# EAGLE board headstage-256_via-reduce (EAGLE 8.3.2), part 1 of 4
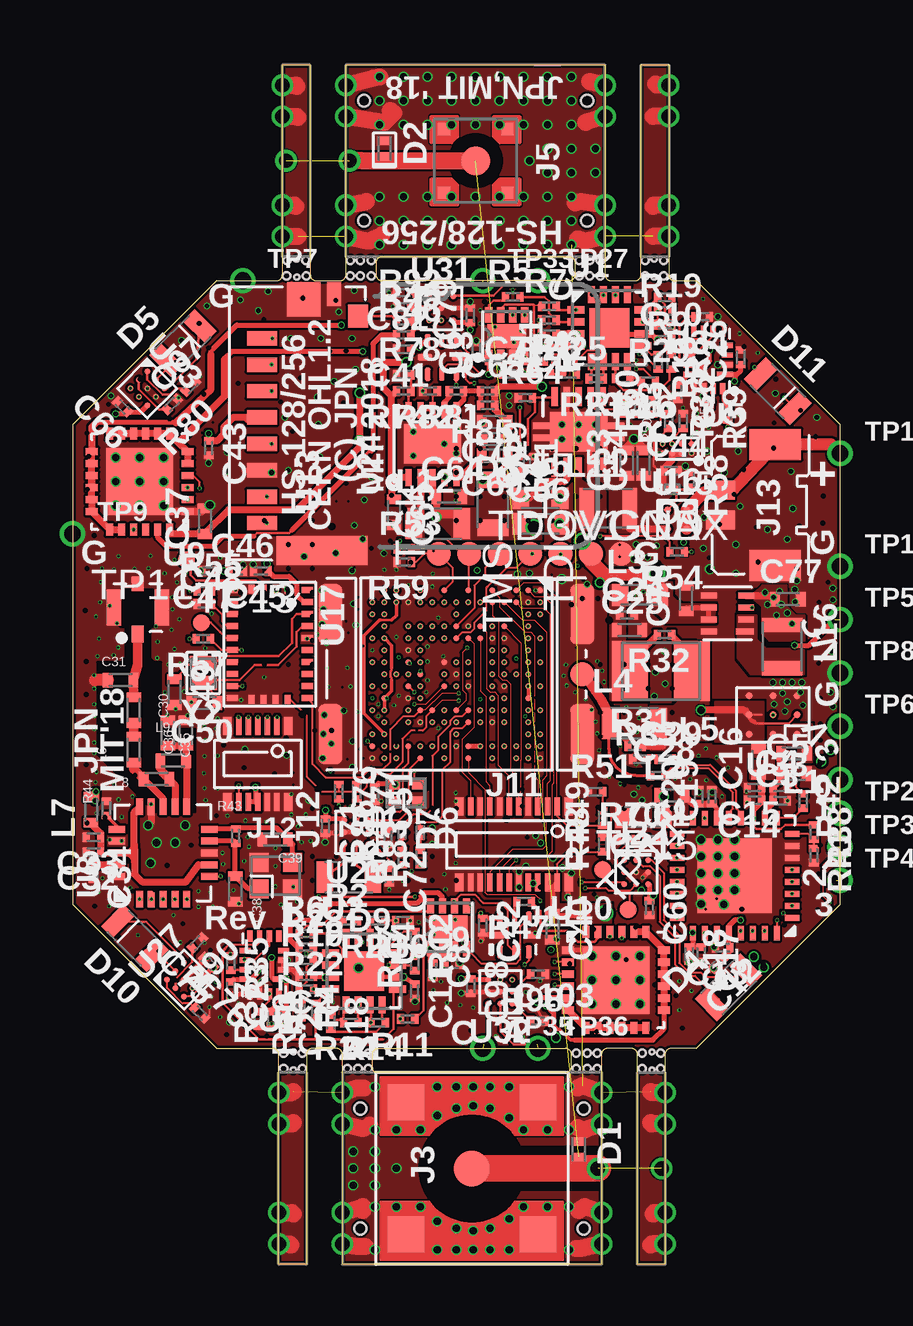
[diagram p10: board, top side]
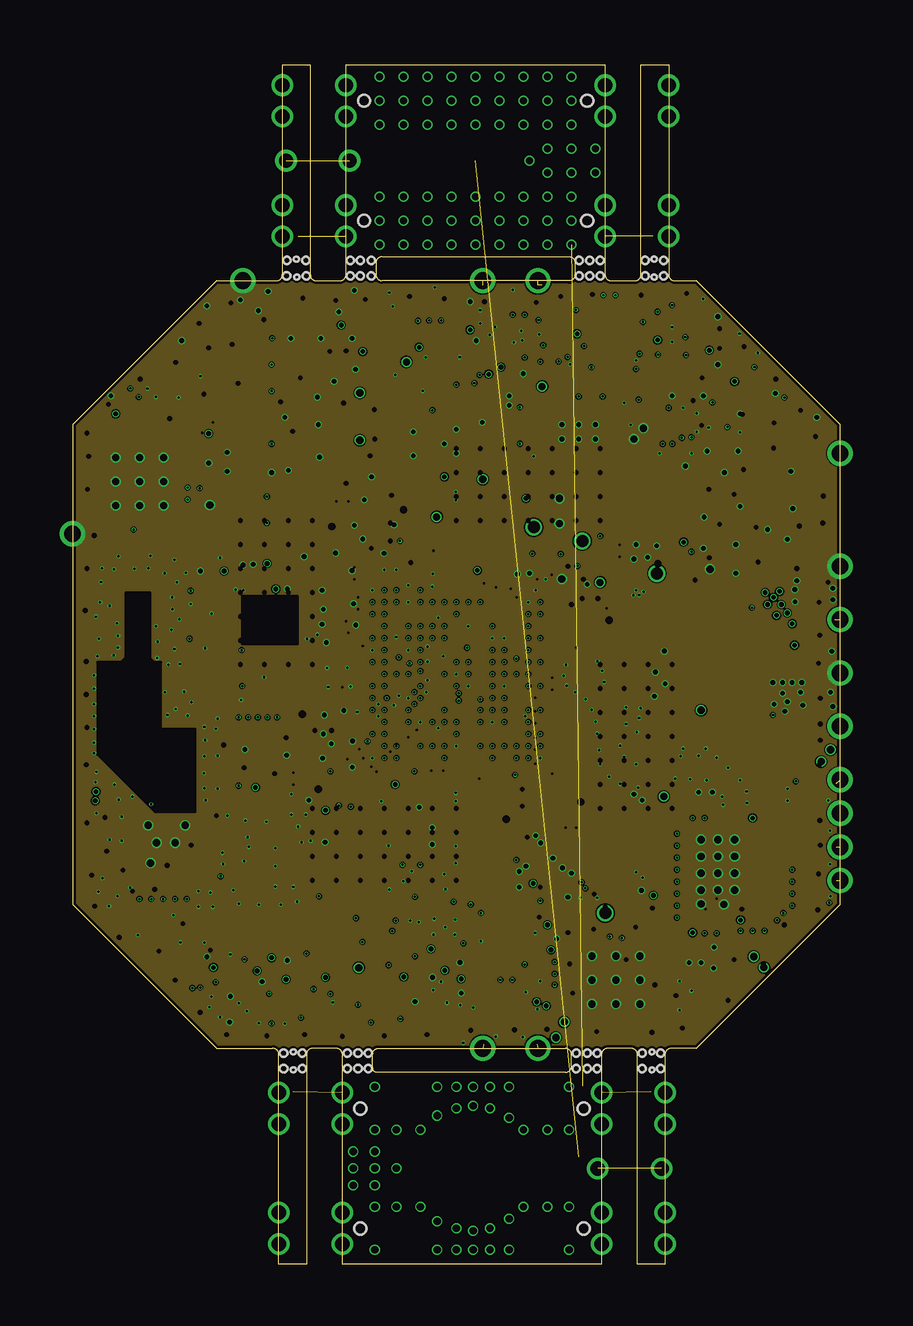
[diagram p11: board, inner layer GND1]
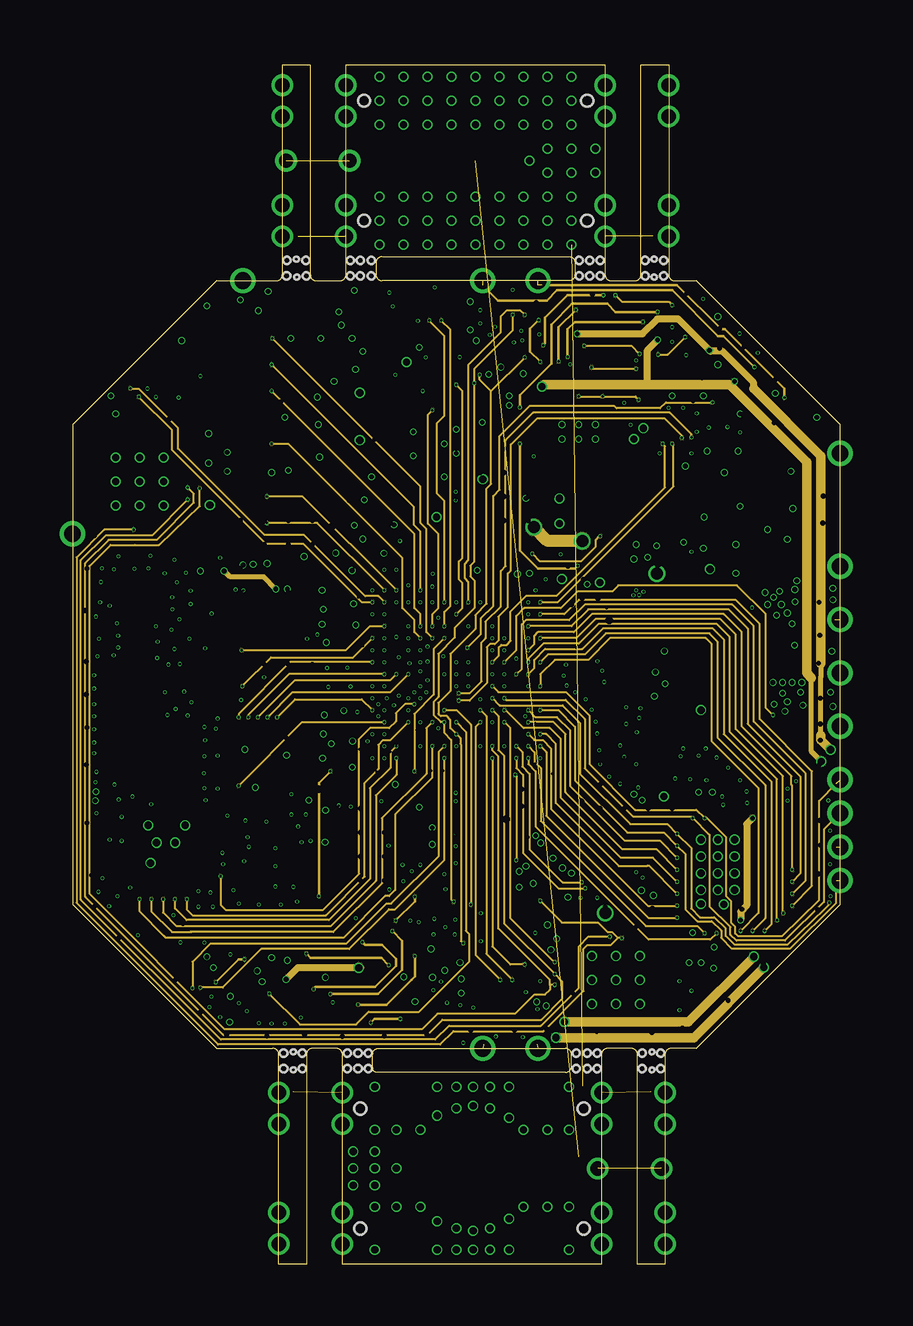
[diagram p12: board, inner layer Signal]
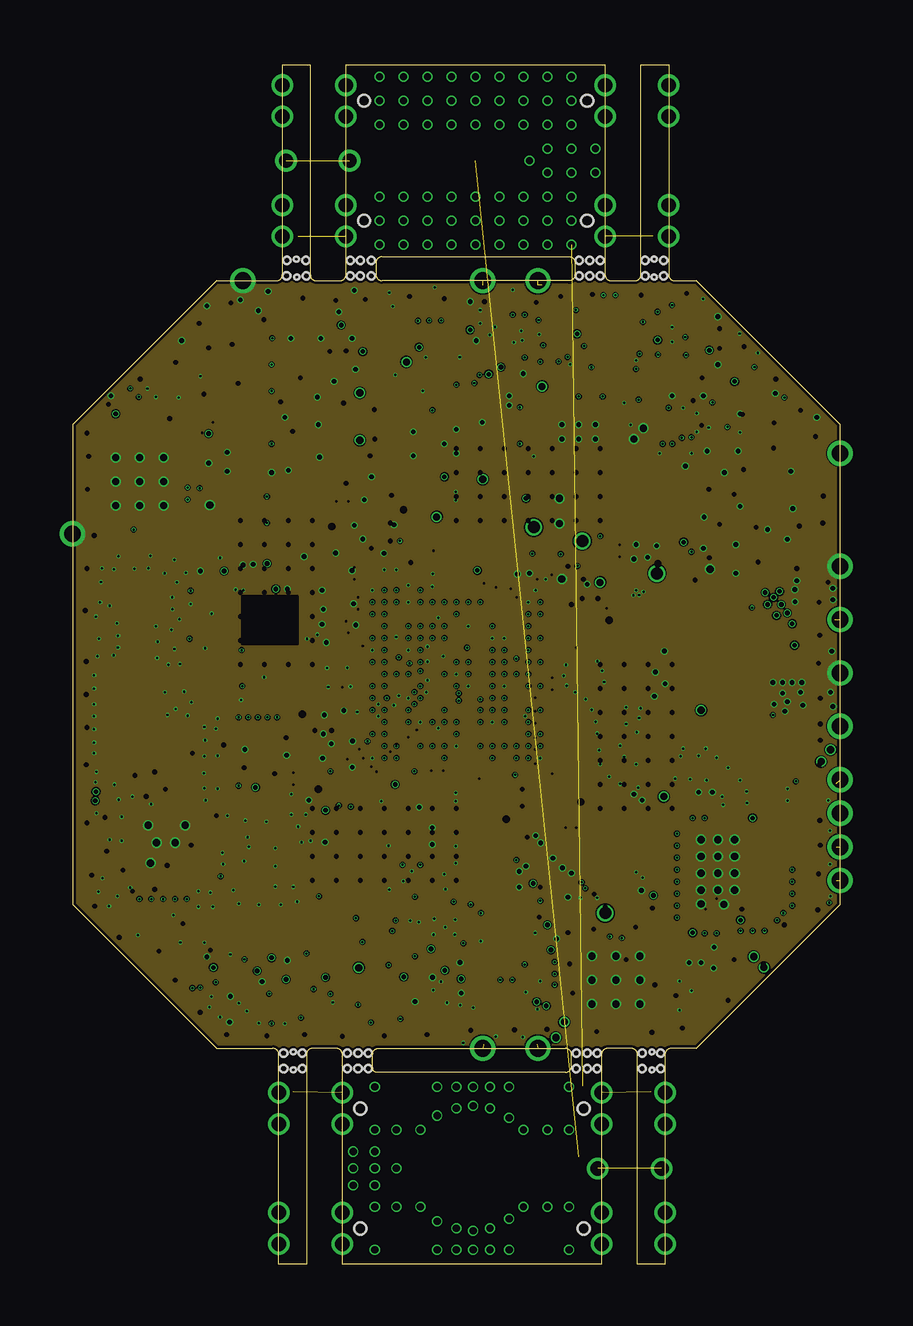
[diagram p13: board, inner layer GND2]
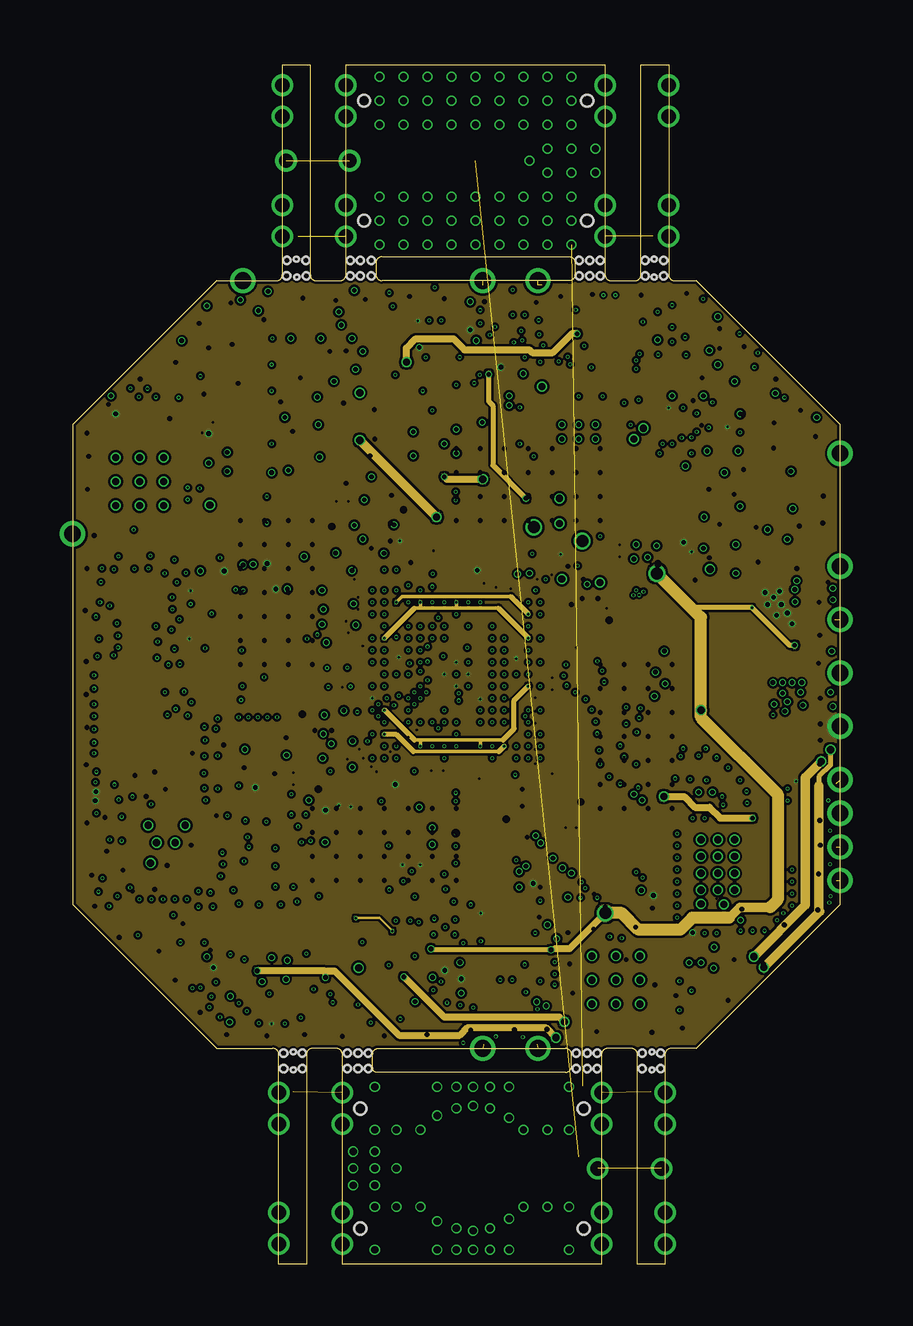
[diagram p14: board, inner layer Supply]
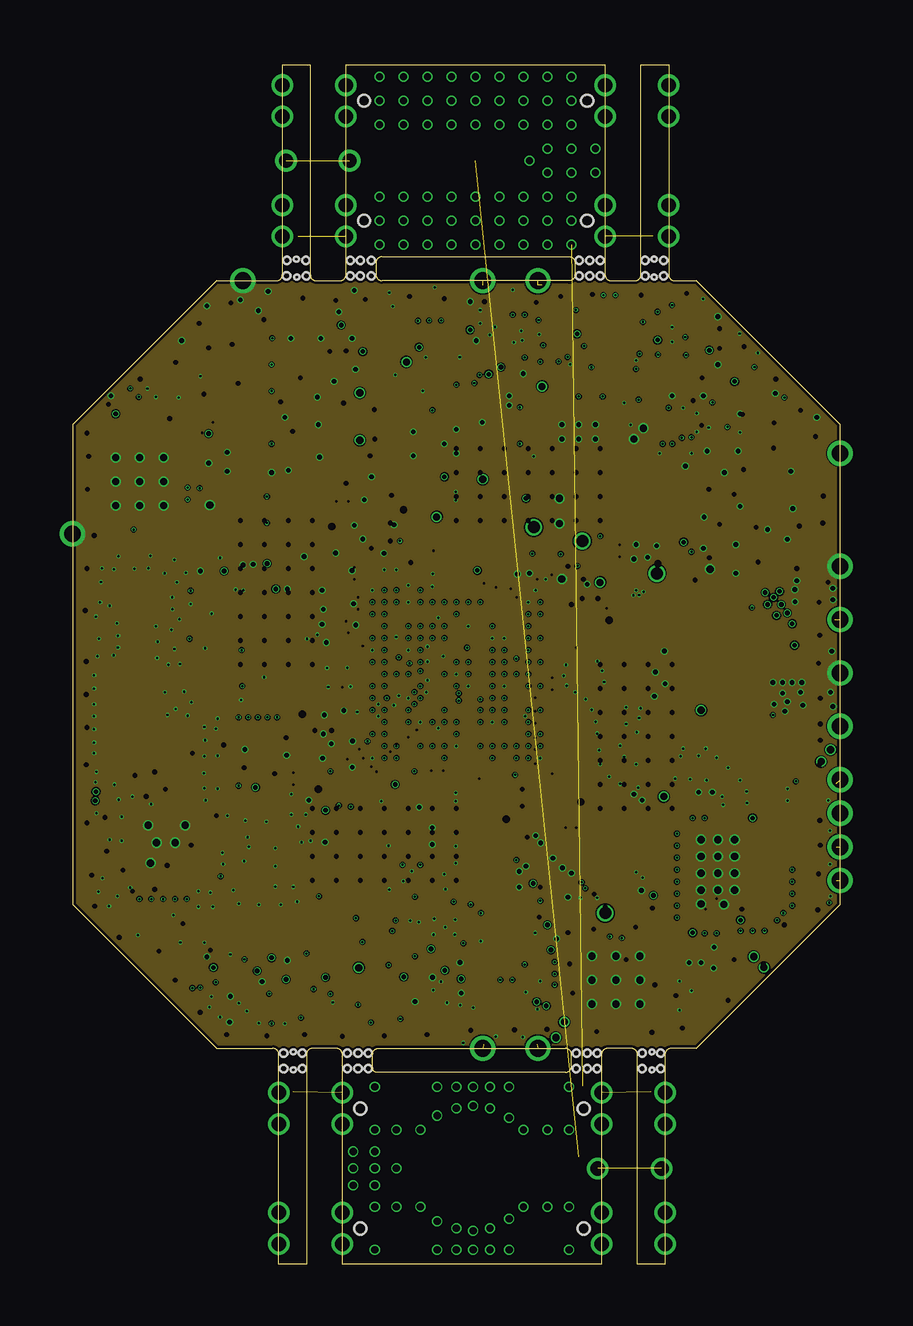
[diagram p15: board, inner layer GND3]
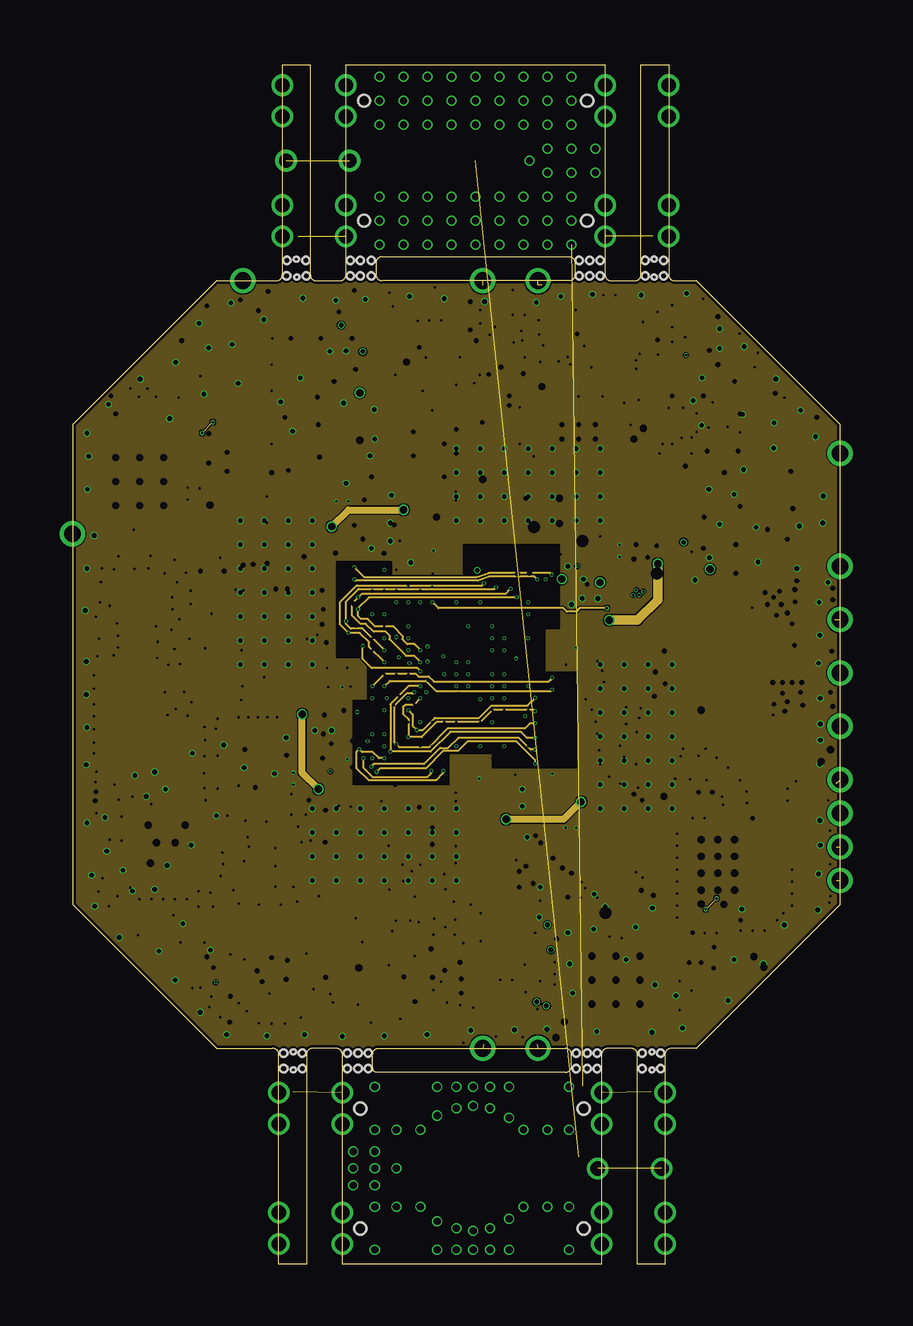
[diagram p16: board, inner layer AGND]
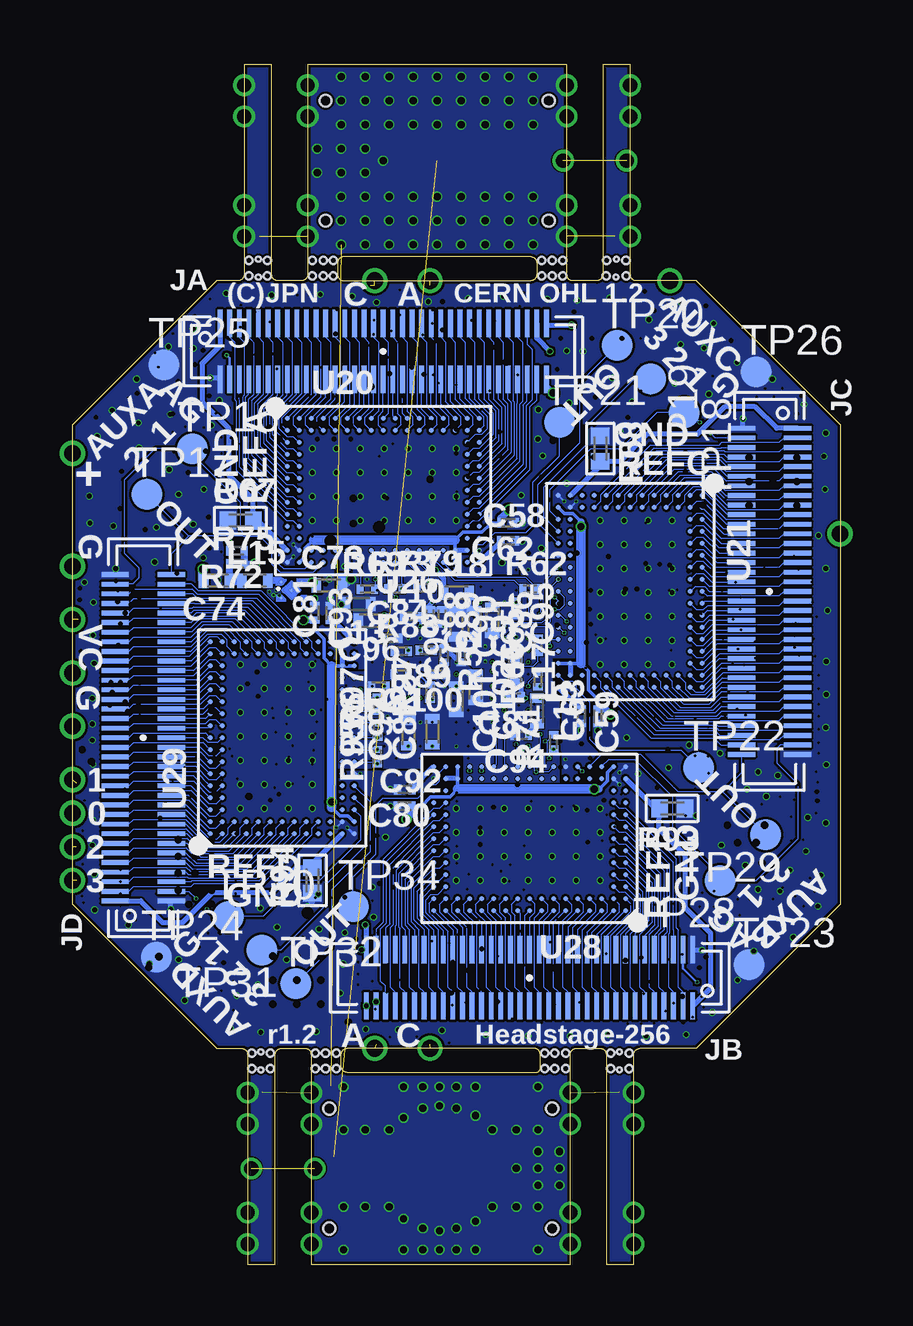
[diagram p17: board, bottom side, seen from below]

Size 32 x 50 mm. Coordinates in mm from the lower left corner, seen from the top.
Outline: 32,15 32,35 26,41 25.1,41 arc-90 24.85,41.25 24.85,50 23.7,50 23.7,41.25 arc-90 23.45,41 22.45,41 arc-90 22.2,41.25 22.2,50 11.4,50 11.4,41.25 arc-90 11.15,41 10.15,41 arc-90 9.9,41.25 9.9,50 8.75,50 8.75,41.25 arc-90 8.5,41 6,41 0,35 0,15 6,9 8.35,9 arc-90 8.6,8.75 8.6,0 9.75,0 9.75,8.75 arc-90 10,9 11,9 arc-90 11.25,8.75 11.25,0 22.05,0 22.05,8.75 arc-90 22.3,9 23.3,9 arc-90 23.55,8.75 23.55,0 24.7,0 24.7,8.75 arc-90 24.95,9 26,9 32,15
Outline: 12.9,42 arc90 12.65,41.75 12.65,41.25 arc90 12.9,41 20.7,41 arc90 20.95,41.25 20.95,41.75 arc90 20.7,42 12.9,42
Outline: 20.55,8 arc90 20.8,8.25 20.8,8.75 arc90 20.55,9 12.75,9 arc90 12.5,8.75 12.5,8.25 arc90 12.65,8 20.55,8
Copper layers ((1*2*3*4+5*6)*(7*16)): Top 0.019mm / dielectric 0.0622mm / GND1 0.019mm / dielectric 0.0622mm / Signal 0.019mm / dielectric 0.0622mm / GND2 0.019mm / dielectric 0.326mm / Supply 0.019mm / dielectric 0.0622mm / GND3 0.019mm / dielectric 0.0622mm / AGND 0.019mm / dielectric 0.0622mm / Bottom 0.019mm
Design rules "headstage-256 *": minimum track width 2mil, minimum drill 3mil, track to track 2mil, track to pad 2mil, pad to pad 2mil, via to via 2mil, smd to smd 2mil, copper to edge 5mil, drill to drill 5mil, minimum pad ring 2mil, minimum via ring 1mil, stop-mask expansion 1mil, vias tented up to drill 1mm, thermal gap 10mil
Net classes: 1 thick: width 0.102 mm
Holes 0.3 mm at 9.75,41.2 8.93,41.2 24.65,41.85 23.88,41.85 24.65,41.2 23.88,41.2 12.45,41.85 12,41.85 11.57,41.85 12.45,41.2 12,41.2 11.57,41.2 22,41.85 21.55,41.85 21.12,41.85 22,41.2 21.55,41.2 21.12,41.2 23.75,8.15 24.52,8.15 23.75,8.8 24.52,8.8 8.8,8.15 9.57,8.15 8.8,8.8 9.57,8.8 21,8.15 21.45,8.15 21.88,8.15 21,8.8 21.45,8.8 21.88,8.8 11.45,8.15 11.9,8.15 12.32,8.15 11.45,8.8 11.9,8.8 12.32,8.8 8.93,41.85 9.73,41.85
Holes 0.2 mm at 9.35,41.15 24.25,41.9 24.25,41.15 24.15,8.1 24.15,8.85 9.2,8.1 9.2,8.85 9.33,41.9
Holes 0.5 mm at 21.3,6.5 21.3,1.5 12,1.5 12,6.5 12.15,43.5 12.15,48.5 21.45,48.5 21.45,43.5
tRestrict: area 14.4,1.8 to 18.9,6.2; 10 lines

## Footprints (pad centres in the part's own frame; a part is rotated, then mirrored left to right if it is on the bottom)
TP10R = smd 1 x 1: TP 0,0
0201T = smd 0.3 x 0.4: 1 -0.3,0; 2 0.3,0
0402T = smd 0.4 x 0.6: 1 -0.533,0; 2 0.533,0
0603T = smd 0.7 x 0.9: 1 -0.82,0; 2 0.82,0
0402T-DFN = smd 0.35 x 0.6: A -0.325,0; C 0.325,0
0402P-DFN = smd 0.35 x 0.6: A -0.325,0; C 0.325,0
GDZ8V2BLP3 = smd 0.23 x 0.3: A -0.177,0; C 0.177,0
0805PT = smd 0.7 x 1.3: A -1,0; C 1,0
LED-0201T = smd 0.2 x 0.35: 1 -0.2,0; 2 0.2,0
CLP1006-2L = smd 0.24 x 0.49: A -0.325,0; C 0.325,0
COAX-ADAPTER-8X8MM-SIG-THRU = drill 0.6: GND1 0,3.15; GND2 0,1.85; GND3 0,-1.85; GND4 0,-3.15; SIG -0.15,0
SMA_VERT = smd 1.5 x 1.5: G1 -2.75,2.75; G2 -2.75,-2.75; G3 2.75,-2.75; G4 2.75,2.75; SIG 0,0
COAX-ADAPTER-8X8MM-THRU = drill 0.6: GND1 -5.4,3.15; GND2 5.4,-1.85; GND3 5.4,1.85; GND5 -5.4,-3.15; GND6 -5.4,-1.85; GND7 -5.4,1.85; GND9 5.4,3.15; GND12 5.4,-3.15; SIG 5.25,0
MMCX-SMT-VERT = smd 0.5 x 0.5: GND@1 -1.325,1.325; GND@2 -1.325,-1.325; GND@3 1.325,-1.325; GND@4 1.325,1.325 | smd 1.2 x 1.2: SIG 0,0
COAX-ADAPTER-8X8MM-GND-THRU = drill 0.6: GND1 0,3.15; GND2 0,1.85; GND3 0,-1.85; GND4 0,-3.15
COAX-ADAPTER-8X8MM = smd 1 x 2.5: GND1 5.25,2.5; GND2 5.25,-2.5; GND3 -5.25,-2.5; GND4 -5.25,2.5 | smd 1 x 1: SIG 5.25,0
X_FL_R_SMT_1(02) = smd 0.5 x 0.7: P$1 0,-1.1 | smd 0.6 x 1.5: P$2 -1,0; P$4 1,0 | smd 0.5 x 0.6: P$3 0,1
DF40-20HEAD = smd 0.23 x 0.75: 1 -1.8,-1.585; 2 -1.4,-1.585; 3 -1,-1.585; 4 -0.6,-1.585; 5 -0.2,-1.585; 6 0.2,-1.585; 7 0.6,-1.585; 8 1,-1.585; 9 1.4,-1.585; 10 1.8,-1.585; 11 1.8,1.585; 12 1.4,1.585; 13 1,1.585; 14 0.6,1.585; 15 0.2,1.585; 16 -0.2,1.585; 17 -0.6,1.585; 18 -1,1.585; 19 -1.4,1.585; 20 -1.8,1.585 | smd 0.35 x 0.75: M1 -2.275,-1.585; M2 2.275,-1.585; M3 2.275,1.585; M4 -2.275,1.585
DF40-10HEAD = smd 0.23 x 0.75: 1 -0.8,-1.585; 2 -0.4,-1.585; 3 0,-1.585; 4 0.4,-1.585; 5 0.8,-1.585; 6 0.8,1.585; 7 0.4,1.585; 8 0,1.585; 9 -0.4,1.585; 10 -0.8,1.585 | smd 0.35 x 0.75: M1 -1.275,-1.585; M2 1.275,-1.585; M3 1.275,1.585; M4 -1.275,1.585
MICROLOCK-1X2-VERT = smd 0.8 x 1.2: 1 -0.625,0; 2 0.625,0 | smd 1.3 x 2.15: M1 -2.525,2.295; M2 2.525,2.295
DF40-70REC = smd 0.2 x 1.14: 1 -6.8,1.17; 2 -6.4,1.17; 3 -6,1.17; 4 -5.6,1.17; 5 -5.2,1.17; 6 -4.8,1.17; 7 -4.4,1.17; 8 -4,1.17; 9 -3.6,1.17; 10 -3.2,1.17; 11 -2.8,1.17; 12 -2.4,1.17; 13 -2,1.17; 14 -1.6,1.17; 15 -1.2,1.17; 16 -0.8,1.17; 17 -0.4,1.17; 18 0,1.17; 19 0.4,1.17; 20 0.8,1.17; 21 1.2,1.17; 22 1.6,1.17; 23 2,1.17; 24 2.4,1.17; 25 2.8,1.17; 26 3.2,1.17; 27 3.6,1.17; 28 4,1.17; 29 4.4,1.17; 30 4.8,1.17; 31 5.2,1.17; 32 5.6,1.17; 33 6,1.17; 34 6.4,1.17; 35 6.8,1.17; 36 6.8,-1.17; 37 6.4,-1.17; 38 6,-1.17; 39 5.6,-1.17; 40 5.2,-1.17; 41 4.8,-1.17; 42 4.4,-1.17; 43 4,-1.17; 44 3.6,-1.17; 45 3.2,-1.17; 46 2.8,-1.17; 47 2.4,-1.17; 48 2,-1.17; 49 1.6,-1.17; 50 1.2,-1.17; 51 0.8,-1.17; 52 0.4,-1.17; 53 0,-1.17; 54 -0.4,-1.17; 55 -0.8,-1.17; 56 -1.2,-1.17; 57 -1.6,-1.17; 58 -2,-1.17; 59 -2.4,-1.17; 60 -2.8,-1.17; 61 -3.2,-1.17; 62 -3.6,-1.17; 63 -4,-1.17; 64 -4.4,-1.17; 65 -4.8,-1.17; 66 -5.2,-1.17; 67 -5.6,-1.17; 68 -6,-1.17; 69 -6.4,-1.17; 70 -6.8,-1.17
0805T = smd 0.7 x 1.3: 1 -1,0; 2 1,0
1210T = smd 1.5 x 2.5: 1 -1.3,0; 2 1.3,0
0806T = smd 0.6 x 1.7: 1 -0.9,0; 2 0.9,0
0402 = smd 0.686 x 0.762: 1 -0.533,0; 2 0.533,0
TESTPOINT_0.7MM = drill 0.7: 1 0,0
TP07R = smd 0.7 x 0.7: TP 0,0
TP13R = smd 1.3 x 1.3: TP 0,0
CP_16_27-L = smd 0.711 x 0.305: 1 -1.397,0.75; 2 -1.397,0.25; 3 -1.397,-0.25; 4 -1.397,-0.75; 9 1.397,-0.75; 10 1.397,-0.25; 11 1.397,0.25; 12 1.397,0.75 | smd 0.305 x 0.711: 5 -0.75,-1.397; 6 -0.25,-1.397; 7 0.25,-1.397; 8 0.75,-1.397; 13 0.75,1.397; 14 0.25,1.397; 15 -0.25,1.397; 16 -0.75,1.397 | smd 1.651 x 1.651: PAD 0,0
CP_8_10-L = smd 0.635 x 0.305: 1 -0.889,0.75; 2 -0.889,0.25; 3 -0.889,-0.25; 4 -0.889,-0.75; 5 0.889,-0.75; 6 0.889,-0.25; 7 0.889,0.25; 8 0.889,0.75 | smd 0.991 x 1.6: PAD 0,0
MQFN16-1.8X2.6 = smd 0.663 x 0.225: 1 -0.7,0.6 | smd 0.463 x 0.225: 2 -0.8,0.2; 3 -0.8,-0.2; 4 -0.8,-0.6; 9 0.8,-0.6; 10 0.8,-0.2; 11 0.8,0.2; 12 0.8,0.6 | smd 0.225 x 0.463: 5 -0.6,-1.2; 6 -0.2,-1.2; 7 0.2,-1.2; 8 0.6,-1.2; 13 0.6,1.2; 14 0.2,1.2; 15 -0.2,1.2; 16 -0.6,1.2
WQFN32-5X5 = smd 0.25 x 0.6: 1 1.75,2.4; 2 1.25,2.4; 3 0.75,2.4; 4 0.25,2.4; 5 -0.25,2.4; 6 -0.75,2.4; 7 -1.25,2.4; 8 -1.75,2.4; 17 -1.75,-2.4; 18 -1.25,-2.4; 19 -0.75,-2.4; 20 -0.25,-2.4; 21 0.25,-2.4; 22 0.75,-2.4; 23 1.25,-2.4; 24 1.75,-2.4 | smd 0.6 x 0.25: 9 -2.4,1.75; 10 -2.4,1.25; 11 -2.4,0.75; 12 -2.4,0.25; 13 -2.4,-0.25; 14 -2.4,-0.75; 15 -2.4,-1.25; 16 -2.4,-1.75; 25 2.4,-1.75; 26 2.4,-1.25; 27 2.4,-0.75; 28 2.4,-0.25; 29 2.4,0.25; 30 2.4,0.75; 31 2.4,1.25; 32 2.4,1.75 | smd 3.1 x 3.1: PAD 0,0
QFN20-4X4MM_NO-PAD = smd 0.686 x 0.293: 1 -1.925,0.986; 2 -1.925,0.493; 3 -1.925,0; 4 -1.925,-0.493; 5 -1.925,-0.986; 11 1.925,-0.986; 12 1.925,-0.493; 13 1.925,0; 14 1.925,0.493; 15 1.925,0.986 | smd 0.293 x 0.686: 6 -0.986,-1.925; 7 -0.493,-1.925; 8 0,-1.925; 9 0.493,-1.925; 10 0.986,-1.925; 16 0.986,1.925; 17 0.493,1.925; 18 0,1.925; 19 -0.493,1.925; 20 -0.986,1.925
QFN24-4X4 = smd 0.5 x 0.3: 1 -2,1.25; 2 -2,0.75; 3 -2,0.25; 4 -2,-0.25; 5 -2,-0.75; 6 -2,-1.25; 13 2,-1.25; 14 2,-0.75; 15 2,-0.25; 16 2,0.25; 17 2,0.75; 18 2,1.25 | smd 0.3 x 0.5: 7 -1.25,-2; 8 -0.75,-2; 9 -0.25,-2; 10 0.25,-2; 11 0.75,-2; 12 1.25,-2; 19 1.25,2; 20 0.75,2; 21 0.25,2; 22 -0.25,2; 23 -0.75,2; 24 -1.25,2 | smd 2.8 x 2.8: PAD 0,0
UQFN = smd 0.55 x 0.25: 1 -0.7,0.6; 3 -0.7,-0.6; 5 0.7,-0.6; 7 0.7,0.6 | smd 0.55 x 0.2: 2 -0.7,0; 6 0.7,0 | smd 0.3 x 0.6: 4 0,-0.7; 8 0,0.7
MICRO-SD-473093751 = smd 0.6 x 1.25: CD/DATA3 2.75,-1.4; CLK -0.55,-1.4; CMD 1.65,-1.4; DAT0 -2.75,-1.4; DAT1 -3.85,-1.4; DAT2 3.85,-1.4; VDD 0.55,-1.4; VSS -1.65,-1.4 | smd 1.2 x 3.79: G1 -5,-3.905 | smd 1.45 x 1.4: G2 5.475,-3.15 | smd 1 x 0.6: G3 5.7,-4.4 | smd 0.95 x 0.85: G4 4.775,-5.4
MBGA153-8X8 = smd 0.25 x 0.25: A1 -3.5,3.5; A2 -3,3.5; A3 -2.5,3.5; A5 -1.5,3.5; A7 -0.5,3.5; A9 0.5,3.5; A11 1.5,3.5; A13 2.5,3.5; A14 3,3.5; A15 3.5,3.5; B1 -3.5,3; B2 -3,3; B3 -2.5,3; B4 -2,3; B5 -1.5,3; B6 -1,3; B7 -0.5,3; B8 0,3; B9 0.5,3; B10 1,3; B11 1.5,3; B12 2,3; B13 2.5,3; B14 3,3; B15 3.5,3; C1 -3.5,2.5; C2 -3,2.5; C8 0,2.5; C14 3,2.5; C15 3.5,2.5; D2 -3,2; D4 -2,2; D5 -1.5,2; D6 -1,2; D7 -0.5,2; D8 0,2; D9 0.5,2; D10 1,2; D11 1.5,2; D12 2,2; D14 3,2; E1 -3.5,1.5; E2 -3,1.5; E4 -2,1.5; E5 -1.5,1.5; E6 -1,1.5; E7 -0.5,1.5; E8 0,1.5; E9 0.5,1.5; E10 1,1.5; E11 1.5,1.5; E12 2,1.5; E14 3,1.5; E15 3.5,1.5; F2 -3,1; F4 -2,1; F5 -1.5,1; F11 1.5,1; F12 2,1; F14 3,1; G1 -3.5,0.5; G2 -3,0.5; G4 -2,0.5; G5 -1.5,0.5; G7 -0.5,0.5; G8 0,0.5; G9 0.5,0.5; G11 1.5,0.5; G12 2,0.5; G14 3,0.5; G15 3.5,0.5; H2 -3,0; H3 -2.5,0; H4 -2,0; H5 -1.5,0; H7 -0.5,0; H8 0,0; H9 0.5,0; H11 1.5,0; H12 2,0; H13 2.5,0; H14 3,0; J1 -3.5,-0.5; J2 -3,-0.5; J4 -2,-0.5; J5 -1.5,-0.5; J7 -0.5,-0.5; J8 0,-0.5; J9 0.5,-0.5; J11 1.5,-0.5; J12 2,-0.5; J14 3,-0.5; J15 3.5,-0.5; K2 -3,-1; K4 -2,-1; K5 -1.5,-1; K11 1.5,-1; K12 2,-1; K14 3,-1; L1 -3.5,-1.5; L2 -3,-1.5; L4 -2,-1.5; L5 -1.5,-1.5; L6 -1,-1.5; L7 -0.5,-1.5; L8 0,-1.5; L9 0.5,-1.5; L10 1,-1.5; L11 1.5,-1.5; L12 2,-1.5; L14 3,-1.5; L15 3.5,-1.5; M2 -3,-2; M4 -2,-2; M5 -1.5,-2; M6 -1,-2; M7 -0.5,-2; M8 0,-2; M9 0.5,-2; M10 1,-2; M11 1.5,-2; M12 2,-2; M14 3,-2; N1 -3.5,-2.5; N2 -3,-2.5; N8 0,-2.5; N14 3,-2.5; N15 3.5,-2.5; P1 -3.5,-3; P2 -3,-3; P3 -2.5,-3; P4 -2,-3; P5 -1.5,-3; P6 -1,-3; P7 -0.5,-3; P8 0,-3; P9 0.5,-3; P10 1,-3; P11 1.5,-3; P12 2,-3; P13 2.5,-3; P14 3,-3; P15 3.5,-3; R1 -3.5,-3.5; R2 -3,-3.5; R3 -2.5,-3.5; R5 -1.5,-3.5; R7 -0.5,-3.5; R9 0.5,-3.5; R11 1.5,-3.5; R13 2.5,-3.5; R14 3,-3.5; R15 3.5,-3.5
MICROFOOT-1.6X1.6MM = smd 0.3 x 0.3: 1 -0.4,0.4; 2 0.4,0.4; 3 0.4,-0.4; 4 -0.4,-0.4
WLP8-1.7X0.9 = smd 0.25 x 0.25: A1 -0.6,0.2; A2 -0.2,0.2; A3 0.2,0.2; A4 0.6,0.2; B1 -0.6,-0.2; B2 -0.2,-0.2; B3 0.2,-0.2; B4 0.6,-0.2
LGA-28-3.8X5.2 = smd 0.25 x 0.475: 1 -2.25,1.56; 6 -2.25,-1.56; 7 -1.75,-1.56; 8 -1.25,-1.56; 9 -0.75,-1.56; 10 -0.25,-1.56; 11 0.25,-1.56; 12 0.75,-1.56; 13 1.25,-1.56; 14 1.75,-1.56; 15 2.25,-1.56; 20 2.25,1.56; 21 1.75,1.56; 22 1.25,1.56; 23 0.75,1.56; 24 0.25,1.56; 25 -0.25,1.56; 26 -0.75,1.56; 27 -1.25,1.56; 28 -1.75,1.56 | smd 0.375 x 0.25: 2 -2.3,0.75; 3 -2.3,0.25; 4 -2.3,-0.25; 5 -2.3,-0.75; 16 2.3,-0.75; 17 2.3,-0.25; 18 2.3,0.25; 19 2.3,0.75
ASCO = smd 0.6 x 0.5: 1 -0.55,-0.4; 2 0.55,-0.4; 3 0.55,0.4; 4 -0.55,0.4
PWSON-N10+4-3X3 = smd 0.8 x 0.28: 1 -1.475,1; 2 -1.475,0.5; 3 -1.475,0; 4 -1.475,-0.5; 5 -1.475,-1; 6 1.475,-1; 7 1.475,-0.5; 8 1.475,0; 9 1.475,0.5; 10 1.475,1 | smd 1.65 x 2.4: PAD 0,0 | smd 0.28 x 0.7: PAD1 -0.25,1.55; PAD2 0.25,1.55; PAD3 0.25,-1.55; PAD4 -0.25,-1.55
BGA104_0.5MM = smd 0.2 x 0.2: A1 -4,3; A2 -3.5,3; A3 -3,3; A4 -2.5,3; A5 -2,3; A6 -1.5,3; A7 -1,3; A8 -0.5,3; A9 0,3; A10 0.5,3; A11 1,3; A12 1.5,3; A13 2,3; A14 2.5,3; A15 3,3; A16 3.5,3; A17 4,3; B1 -4,2.5; B2 -3.5,2.5; B3 -3,2.5; B4 -2.5,2.5; B5 -2,2.5; B6 -1.5,2.5; B7 -1,2.5; B8 -0.5,2.5; B9 0,2.5; B10 0.5,2.5; B11 1,2.5; B12 1.5,2.5; B13 2,2.5; B14 2.5,2.5; B15 3,2.5; B16 3.5,2.5; B17 4,2.5; C1 -4,2; C2 -3.5,2; C16 3.5,2; C17 4,2; D1 -4,1.5; D2 -3.5,1.5; D16 3.5,1.5; D17 4,1.5; E1 -4,1; E2 -3.5,1; E16 3.5,1; E17 4,1; F1 -4,0.5; F2 -3.5,0.5; F16 3.5,0.5; F17 4,0.5; G1 -4,0; G2 -3.5,0; G16 3.5,0; G17 4,0; H1 -4,-0.5; H2 -3.5,-0.5; H16 3.5,-0.5; H17 4,-0.5; J1 -4,-1; J2 -3.5,-1; J16 3.5,-1; J17 4,-1; K1 -4,-1.5; K2 -3.5,-1.5; K16 3.5,-1.5; K17 4,-1.5; L1 -4,-2; L2 -3.5,-2; L16 3.5,-2; L17 4,-2; M1 -4,-2.5; M2 -3.5,-2.5; M3 -3,-2.5; M4 -2.5,-2.5; M5 -2,-2.5; M6 -1.5,-2.5; M7 -1,-2.5; M8 -0.5,-2.5; M9 0,-2.5; M10 0.5,-2.5; M11 1,-2.5; M12 1.5,-2.5; M13 2,-2.5; M14 2.5,-2.5; M15 3,-2.5; M16 3.5,-2.5; M17 4,-2.5; N1 -4,-3; N2 -3.5,-3; N3 -3,-3; N4 -2.5,-3; N5 -2,-3; N6 -1.5,-3; N7 -1,-3; N8 -0.5,-3; N9 0,-3; N10 0.5,-3; N11 1,-3; N12 1.5,-3; N13 2,-3; N14 2.5,-3; N15 3,-3; N16 3.5,-3; N17 4,-3
WLCSP3X3 = smd 0.25 x 0.25: A1 -0.5,0.5; A2 0,0.5; A3 0.5,0.5; B1 -0.5,0; B2 0,0; B3 0.5,0; C1 -0.5,-0.5; C2 0,-0.5; C3 0.5,-0.5
DFN103X3 = smd 0.7 x 0.25: 1 -1.4,1; 2 -1.4,0.5; 3 -1.4,0; 4 -1.4,-0.5; 5 -1.4,-1; 6 1.4,-1; 7 1.4,-0.5; 8 1.4,0; 9 1.4,0.5; 10 1.4,1 | smd 1.65 x 2.38: PAD 0,0
X2SON = smd 0.1 x 0.1: 1 -0.43,0.33; 2 -0.43,-0.33; 3 0.43,-0.33; 4 0.43,0.33 | smd 0.1 x 0.1 rotated 45: PAD 0,0
TDFN_2X2MM = smd 0.75 x 0.25: 1 -0.725,0.75 | smd 0.65 x 0.25: 2 -0.775,0.25; 3 -0.775,-0.25; 4 -0.775,-0.75; 5 0.775,-0.75; 6 0.775,-0.25; 7 0.775,0.25; 8 0.775,0.75
MICROSIP9-3X2.3 = smd 0.3 x 0.3: A1 -1,0.8; A2 0,0.8; A3 1,0.8; B1 -1,0; B2 0,0; B3 1,0; C1 -1,-0.8; C2 0,-0.8; C3 1,-0.8
FW2X1.6MM = smd 0.8 x 0.8: 1 -0.7,-0.55; 2 0.7,-0.55; 3 0.7,0.55; 4 -0.7,0.55
ECX-1210 = smd 1.14 x 0.575: P$1 0,-0.412; P$2 0,0.412

## Placement (x,y rotation side)
3V1  [TP10R]  20.34,29.62 0 top
C1  0.1uF  [0201T]  19.86,38.77 180 top
C2  0.1uF  [0201T]  9.75,12.01 180 top
C3  10nF  [0201T]  29.5,19.32 0 top
C4  0.1uF  [0201T]  29.5,19.88 0 top
C5  4.7uF  [0402T]  30.07,20.45 0 top
C6  0.1uF  [0201T]  16.83,38.12 90 top
C7  0.1uF  [0201T]  18.22,37.12 0 top
C8  0.1uF  [0201T]  15.01,12.26 270 top
C9  0.1uF  [0201T]  15.82,12.51 0 top
C10  0.1uF  [0201T]  24.69,38.53 0 top
C11  0.1uF  [0201T]  14.26,11.38 270 top
C12  0.1uF  [0201T]  26.93,12.55 225 top
C13  10nF  [0201T]  27.1,13.2 180 top
C14  10nF  [0201T]  28.43,19.35 180 top
C15  0.1uF  [0201T]  28.43,19.88 180 top
C16  4.7uF  [0402T]  28.6,20.95 90 top
C17  0.1uF  [0201T]  26.2,12.93 270 top
C18  10nF  [0201T]  25.7,12.93 270 top
C19  10nF  [0201T]  26.65,19.5 90 top
C20  0.1uF  [0201T]  26.1,19.5 90 top
C21  22uF  [0603T]  23.8,18.65 180 top
C22  0.1uF  [0201T]  25.23,36.35 270 top
C23  0.1uF  [0201T]  6.6,11.47 270 top
C24  0.1uF  [0201T]  23.11,27.07 0 top
C25  4.7uF  [0402T]  23.21,26.44 0 top
C26  0.1uF  [0201T]  27.85,37.8 90 top
C27  0.1uF  [0201T]  8.85,10.23 270 top
C28  0.1uF  [0201T]  24.4,20.38 0 top
C29  47nF  [0201T]  24.7,21.05 0 top
C30  1.5pF, NP0 +/-0.1pF  [0402T]  2.55,23.1 90 top
C31  1.0pF, NP0 +/- 0.1pF  [0402T]  2,24.35 0 top
C32  10nF  [0201T]  0.88,17.18 180 top
C33  1nF  [0201T]  0.88,17.8 180 top
C34  33nF  [0201T]  0.88,16.35 270 top
C35  2.2nF  [0402T]  3.97,22.15 90 top
C36  4.7pF, NP0 +/-0.25pF  [0402T]  4.72,22.15 90 top
C37  1uF  [0402T]  5.53,30.98 90 top
C38  22pF, NP0 2%  [0402T]  6.79,15.65 270 top
C39  22pF, NP0 2%  [0402T]  8.45,17.71 180 top
C40  1uF  [0402T]  20,14.07 270 top
C41  0.1uF  [0201T]  13.8,38.14 180 top
C42  0.1uF  [0201T]  17.1,14.12 270 top
C43  0.1uF  [0201T]  5.68,34.02 270 top
C44  0.1uF  [0201T]  24.95,33.08 0 top
C45  0.1uF  [0201T]  7.85,28.9 180 top
C46  6.8nF  [0201T]  6.82,28.9 0 top
C47  0.1uF  [0201T]  5.7,28.9 180 top
C48  0.1uF  [0201T]  5.5,27.52 0 top
C49  22pF, NP0 2%  [0402T]  4.25,23.85 270 top
C50  22pF, NP0 2%  [0402T]  5.5,23.4 180 top
C51  10nF  [0201T]  12.6,19.6 270 top
C52  0.1uF  [0201T]  23.6,35.74 270 top
C53  4.7uF  [0402T]  23.1,33.4 90 top
C54  4.7uF  [0402T]  23.8,33.4 90 top
C55  22uF  [0603T]  19.5,31.93 0 top
C56  22uF  [0603T]  19.5,30.88 0 top
C57  0.1uF  [0201T]  19.22,33.38 90 top
C58  10nF  [0201T]  13.85,30.16 0 bottom
C59  10nF  [0201T]  10.79,22.85 270 bottom
C60  0.1uF  [0201T]  24.05,14.86 270 top
C61  1uF  [0201T]  24.2,17.7 0 top
C62  0.1uF  [0201T]  13.84,30.91 180 bottom
C63  0.1uF  [0201T]  10.09,22.84 90 bottom
C64  1uF  [0402T]  15.7,32 0 top
C65  0.47uF  [0402T]  13.4,31.35 270 top
C66  0.1uF  [0201T]  2.08,35.74 135 top
C67  1uF  [0201T]  4.93,36.6 45 top
C68  10pF  [0201T]  17.3,36.4 0 top
C69  1uF  [0402T]  17.6,33.7 180 top
C70  0.47uF  [0402T]  17.6,35.1 180 top
C71  0.1uF  [0201T]  10.54,18.27 270 top
C72  1uF  [0201T]  13.2,16.2 270 top
C73  1uF  [0402T]  21.3,28.3 0 bottom
C74  10uF  [0402T]  26,28.5 180 bottom
C75  0.1uF  [0201T]  5.68,12.58 135 top
C76  1uF  [0201T]  5.3,10.47 315 top
C77  4.7uF  [0402T]  29.82,27.73 0 top
C78  4.7uF  [0402T]  25.57,27.75 90 top
C79  0.1uF  [0201T]  16.58,39.55 90 top
C80  10nF  [0201T]  18.15,19.8 180 bottom
C81  10nF  [0201T]  21.25,27.15 90 bottom
C82  1uF  [0201T]  13.8,40.5 180 top
C83  22nF  [0201T]  19.23,24.1 180 bottom
C84  22nF  [0201T]  18.7,26.1 0 bottom
C85  0.1uF  [0201T]  13.6,23.65 180 bottom
C86  4.7uF  [0402T]  14.5,26.85 270 bottom
C87  10uF  [0402T]  17,22.2 90 bottom
C88  22nF  [0201T]  17.1,27 270 bottom
C89  0.1uF  [0201T]  16.6,27 270 bottom
C90  4.7uF  [0402T]  16,26.7 270 bottom
C91  10uF  [0402T]  15.25,26.7 270 bottom
C92  0.1uF  [0201T]  18.16,19.09 0 bottom
C93  0.1uF  [0201T]  21.91,27.16 270 bottom
C94  22nF  [0201T]  13.3,22.05 180 bottom
C95  0.1uF  [0201T]  13.5,27.35 270 bottom
C96  4.7uF  [0402T]  19.55,26.82 180 bottom
C97  10uF  [0402T]  18,22.15 90 bottom
C98  0.1uF  [0201T]  16.6,11.6 270 top
C99  22nF  [0201T]  15.8,25.4 90 bottom
C100  0.1uF  [0201T]  16.8,24.6 180 bottom
C101  4.7uF  [0402T]  16,23.55 270 bottom
C102  10uF  [0402T]  15.2,24.05 270 bottom
C103  1uF  [0201T]  19.4,10.15 0 top
D1  SESD0402X1UN-0020-090  [0402T-DFN]  21.1,4.8 270 top
D2  SESD0402X1UN-0020-090  [0402P-DFN]  13,46.5 270 top
D3  GDZ8V2BLP3-7  [GDZ8V2BLP3]  25,32.3 180 top
D4  VEMD1160X01  [0805PT]  27.35,11.55 45 top
D5  VEMD1160X01  [0805PT]  4.6,38.4 45 top
D6  XZVGR155W  [LED-0201T]  14.5,18 270 top
D7  XZVGR155W  [LED-0201T]  13.73,18 270 top
D8  VSKY05401006  [CLP1006-2L]  17.5,34.4 180 top
D9  VEMD1160X01  [0805PT]  11.52,16.14 180 top
D10  VEMD1160X01  [0805PT]  2.6,13.6 135 top
D11  VEMD1160X01  [0805PT]  29.4,36.4 315 top
GND  [TP10R]  22.88,29.62 0 top
J1  [COAX-ADAPTER-8X8MM-SIG-THRU]  24.7,4 0 top
J2  [COAX-ADAPTER-8X8MM-SIG-THRU]  8.75,46 180 top
J3  142-0711-201  [SMA_VERT]  16.65,4 90 top
J4  [COAX-ADAPTER-8X8MM-THRU]  16.65,4 0 top
J5  MMCX-J-P-H-ST-SM1  [MMCX-SMT-VERT]  16.8,46 180 top
J6  [COAX-ADAPTER-8X8MM-THRU]  16.8,46 180 top
J7  [COAX-ADAPTER-8X8MM-GND-THRU]  8.6,4 180 top
J8  [COAX-ADAPTER-8X8MM-GND-THRU]  24.85,46 0 top
J9  [COAX-ADAPTER-8X8MM]  16,24.6 0 top
J10  X_FL_R_SMT_1(02)  [X_FL_R_SMT_1(02)]  2.72,27.38 0 top
J11  [DF40-20HEAD]  18.4,17.5 180 top
J12  PINHD-2X5+4DF40-HEAD  [DF40-10HEAD]  7.72,20.85 180 top
J13  5041940270  [MICROLOCK-1X2-VERT]  27,31.65 270 top
JA  DF40C(2.0)-70DS-0.4V(51)  [DF40-70REC]  19.05,38.05 0 bottom
JB  DF40C(2.0)-70DS-0.4V(51)  [DF40-70REC]  12.95,11.95 180 bottom
JC  DF40C(2.0)-70DS-0.4V(51)  [DF40-70REC]  2.95,28.05 270 bottom
JD  DF40C(2.0)-70DS-0.4V(51)  [DF40-70REC]  29.05,21.95 90 bottom
L1  BLM15PX601SN1D  [0402T]  30.07,21.3 180 top
L2  BLM15PX601SN1D  [0402T]  24.98,19.55 0 top
L3  BLM18KG601SN1D  [0603T]  23.64,27.9 0 top
L4  CIG21L4R7MNE  [0805T]  23.43,22.55 0 top
L5  CBC3225T101MR  [1210T]  24.52,24.73 180 top
L6  3.9nH, 5%  [0402T]  2.55,21.45 90 top
L7  BLM15PX601SN1D  [0402T]  0.78,18.95 90 top
L8  8.2nH, 5%  [0402T]  3.5,20.23 180 top
L9  2.7nH, 5%  [0402T]  4.2,21 180 top
L10  MMZ0603S601HT000  [0201T]  17.9,27 0 bottom
L11  TFM201610ALM-2R2MTAA, 2.2 uH  [0806T]  22.32,31.51 0 top
L12  MLZ2012M100WT000  [0805T]  15.22,30.88 0 top
L13  BLM15PX601SN1D  [0402T]  20.1,27.52 180 bottom
L14  MLZ2012M100WT000  [0805T]  17.52,31.7 270 top
L15  BLM15PX601SN1D  [0402T]  24.4,28.5 0 bottom
L16  TFM201610ALMA1R5MTAA, 1.5uH  [0806T]  29.57,25.75 270 top
L17  BLM15PX121SN1D  [0402T]  13.55,24.75 270 bottom
L18  BLM15PX601SN1D  [0402T]  16,28 0 bottom
L19  BLM15PX601SN1D  [0402T]  12.64,23.06 270 bottom
R1  9k, 0.1%  [0201T]  19.86,39.36 180 top
R2  9k, 0.1%  [0201T]  11.57,14.32 0 top
R3  1k, 0.1%  [0201T]  19.61,37.92 270 top
R4  1k, 0.1%  [0201T]  9.52,10.58 270 top
R5  10k, 0.1%  [0201T]  18.35,40.32 0 top
R6  10k, 0.1%  [0201T]  9.74,13.79 0 top
R7  10k, 0.1%  [0201T]  19.86,39.93 0 top
R8  10k, 0.1%  [0201T]  24.95,37.62 270 top
R9  10k, 0.1%  [0201T]  24.69,40.3 180 top
R10  10k, 0.1%  [0201T]  9.74,12.68 0 top
R11  10k, 0.1%  [0201T]  13.97,10.23 180 top
R12  10k, 0.1%  [0201T]  14.27,13.58 270 top
R13  10k, 0.1%  [0201T]  22.93,36.93 180 top
R14  10k, 0.1%  [0201T]  12.74,10.08 180 top
R15  100  [0201T]  24.41,37.62 270 top
R16  2.86k  [0201T]  24,36.81 180 top
R17  100  [0201T]  10.14,10.58 90 top
R18  2.86k  [0201T]  10.77,10.09 270 top
R19  10k, 0.1%  [0201T]  24.69,39.74 0 top
R20  10k, 0.1%  [0201T]  12.71,14.33 180 top
R21  10k, 0.1%  [0201T]  20.17,37.92 90 top
R22  10k, 0.1%  [0201T]  9.75,11.47 0 top
R23  10k, 0.1%  [0201T]  21.83,36.92 180 top
R24  10k, 0.1%  [0201T]  11.6,10.08 180 top
R25  10k, 0.1%  [0201T]  20.71,37.11 0 top
R26  10k, 0.1%  [0201T]  19.61,37.11 0 top
R27  10k, 0.1%  [0201T]  14.27,12.54 90 top
R28  10k, 0.1%  [0201T]  9.74,13.23 0 top
R29  10k, 0.1%  [0201T]  24.69,39.17 180 top
R30  10k, 0.1%  [0201T]  13.77,14.33 180 top
R31  1k  [0201T]  23.45,21.6 0 top
R32  1k  [0201T]  24.68,26.25 180 top
R33  49.9  [0201T]  23.65,21.05 0 top
R34  590  [0201T]  26.25,39.5 180 top
R35  590  [0201T]  6.6,12.56 270 top
R36  10k  [0201T]  27.3,35.5 90 top
R37  10k  [0201T]  8.3,10.23 90 top
R38  10k  [0201T]  30.9,18.02 270 top
R39  10k  [0201T]  26.52,35.5 270 top
R40  10k  [0201T]  7.75,10.23 270 top
R41  100k  [0201T]  30.9,17.04 270 top
R42  10k  [0201T]  30.45,19.31 270 top
R43  1M  [0201T]  6.8,17.85 90 top
R44  22K  [0201T]  1.41,19 90 top
R45  10k  [0201T]  13.8,39.32 0 top
R46  590  [0201T]  13.8,38.73 0 top
R47  590  [0201T]  18.82,15.12 180 top
R48  9k, 0.1%  [0201T]  22.1,17.5 90 top
R49  0  [0201T]  22.1,18.6 90 top
R50  4.7k  [0201T]  24.85,35.15 90 top
R51  1k, 0.1%  [0201T]  21.8,19.7 0 top
R52  10k  [0201T]  16.5,25.4 270 bottom
R53  10k  [0201T]  13.82,29.82 0 top
R54  10k  [0201T]  25.2,29.7 180 top
R55  10k  [0201T]  5.5,28.07 0 top
R56  4.7k  [0201T]  25.45,35.15 270 top
R57  10k  [0201T]  5.45,26.07 180 top
R58  1k  [0201T]  25.75,32.7 270 top
R59  1k  [0201T]  13.82,29.27 180 top
R60  2M  [0201T]  24.19,35.74 90 top
R61  2M  [0201T]  18.67,33.38 270 top
R62  100  [0201T]  12.93,28.15 0 bottom
R63  240k  [0201T]  23,35.74 270 top
R64  200k  [0201T]  18.88,36.12 0 top
R65  100  [0201T]  12.6,25.8 90 bottom
R66  100  [0201T]  12.6,24.38 90 bottom
R67  0  [0402]  25,31 0 bottom
R68  0  [0402]  10,34 270 bottom
R69  100  [0201T]  19.71,28.14 0 bottom
R70  15k  [0201T]  23,17.7 0 top
R71  100  [0201T]  11.95,21.77 90 bottom
R72  0 (DNP)  [0201T]  25.15,29.75 180 bottom
R73  100  [0201T]  18.57,28.16 0 bottom
R74  1M  [0201T]  13.8,36.4 180 top
R75  0  [0201T]  25.15,29.2 0 bottom
R76  4.7k  [0201T]  11.1,19.7 270 top
R77  4.7k  [0201T]  11.85,19.7 270 top
R78  90.9k  [0201T]  13.8,37.08 0 top
R79  100  [0201T]  17.35,28.2 0 bottom
R80  15k  [0201T]  4.15,35.84 225 top
R81  83.3k  [0201T]  16,36.4 180 top
R82  10k  [0201T]  14.9,36.4 180 top
R83  2k  [0201T]  14.5,16.95 90 top
R84  2k  [0201T]  13.75,16.95 90 top
R85  1M  [0201T]  17.3,35.8 180 top
R86  15k  [0201T]  13.15,17.8 90 top
R87  10k  [0201T]  17.1,23.85 90 bottom
R88  10k  [0201T]  18.3,25.55 0 bottom
R89  10k  [0201T]  17.25,25.6 180 bottom
R90  15k  [0201T]  5.21,13.4 225 top
R91  10k  [0201T]  18.3,24.6 180 bottom
R92  15k  [0201T]  13.8,39.91 0 top
R93  0  [0402]  7,19 180 bottom
R94  0  [0402]  22,16 90 bottom
R95  100  [0201T]  19.3,21.16 90 bottom
R96  100  [0201T]  19.29,22.26 90 bottom
R97  100  [0201T]  19.3,23.35 90 bottom
R98  15k  [0201T]  19.4,12.1 180 top
TCK  [TP10R]  15.26,29.62 90 top
TDI  [TP10R]  19.07,29.62 270 top
TDO  [TP10R]  17.8,29.62 0 top
TMS  [TP10R]  16.53,29.62 270 top
TP1  [TESTPOINT_0.7MM]  32,20.2 0 top
TP2  [TESTPOINT_0.7MM]  32,18.8 0 top
TP3  [TESTPOINT_0.7MM]  32,17.4 0 top
TP4  [TESTPOINT_0.7MM]  32,16 0 top
TP5  [TESTPOINT_0.7MM]  32,26.88 0 top
TP6  [TESTPOINT_0.7MM]  32,22.43 0 top
TP7  [TESTPOINT_0.7MM]  7.1,41 0 top
TP8  [TESTPOINT_0.7MM]  32,24.65 0 top
TP9  [TESTPOINT_0.7MM]  0,30.45 0 top
TP10  [TESTPOINT_0.7MM]  32,33.8 0 top
TP11  [TP07R]  4.75,29.38 180 top
TP12  [TESTPOINT_0.7MM]  32,29.1 0 top
TP13  [TP07R]  5.38,26.75 0 top
TP14  [TP07R]  23.16,14.79 45 top
TP15  [TP07R]  22.1,16.45 0 top
TP16  [TP13R]  27,34 0 bottom
TP17  [TP13R]  28.9,32.1 0 bottom
TP18  [TP13R]  6.5,35.5 270 bottom
TP19  [TP13R]  7.9,36.9 270 bottom
TP20  [TP13R]  9.3,38.3 0 bottom
TP21  [TP13R]  11.7,35.1 0 bottom
TP22  [TP13R]  5.9,20.7 0 bottom
TP23  [TP13R]  3.8,12.5 0 bottom
TP24  [TP13R]  28.5,12.8 0 bottom
TP25  [TP13R]  28.2,37.5 0 bottom
TP26  [TP13R]  3.5,37.2 0 bottom
TP27  [TESTPOINT_0.7MM]  19.4,41 0 top
TP28  [TP13R]  5,16 180 bottom
TP29  [TP13R]  3.1,17.9 180 bottom
TP30  [TP13R]  25.5,14.5 0 bottom
TP31  [TP13R]  24.1,13.1 180 bottom
TP32  [TP13R]  22.7,11.7 0 bottom
TP33  [TESTPOINT_0.7MM]  17.1,41 0 top
TP34  [TP13R]  20.3,14.9 0 bottom
TP35  [TESTPOINT_0.7MM]  17.1,9 0 top
TP36  [TESTPOINT_0.7MM]  19.4,9 0 top
U1  ADA4062-4ACPZ-R7  [CP_16_27-L]  22.38,39.03 0 top
U2  ADA4062-4ACPZ-R7  [CP_16_27-L]  12.15,12.22 0 top
U3  AD5681RBCPZ-1RL7  [CP_8_10-L]  18.1,38.69 90 top
U4  AD5681RBCPZ-1RL7  [CP_8_10-L]  15.67,14.05 90 top
U5  DG509B  [MQFN16-1.8X2.6]  26.5,37.7 180 top
U6  DG509B  [MQFN16-1.8X2.6]  8,12.48 180 top
U7  DS90UB913A_WQFN  [WQFN32-5X5]  27.6,16.2 270 top
U8  NRF24L01QFN  [QFN20-4X4MM_NO-PAD]  3.78,17.15 90 top
U9  CAT4016_QFN  [QFN24-4X4]  2.8,32.62 180 top
U10  CAT4016_QFN  [QFN24-4X4]  22.65,11.85 0 top
U11  TPL0501_UQFN  [UQFN]  15.4,37.8 90 top
U12  TPL0501_UQFN  [UQFN]  18.43,13.72 90 top
U13  MICROSD_473093751  [MICRO-SD-473093751]  6.5,34.75 90 top
U14  10M08SAM15317G  [MBGA153-8X8]  16,24.6 270 top
U15  Si8487DB  [MICROFOOT-1.6X1.6MM]  25.2,31.05 0 top
U16  MAX17048_WLP  [WLP8-1.7X0.9]  25.2,34 180 top
U17  BNO055  [LGA-28-3.8X5.2]  8.22,25.85 270 top
U18  ASCO-50.000MHZ-EK-T3  [ASCO]  13.9,19.65 0 top
U19  TPS61202  [PWSON-N10+4-3X3]  21.1,34.7 90 top
U20  RHD2064_BGA  [BGA104_0.5MM]  19.05,32.26 0 bottom
U21  RHD2064_BGA  [BGA104_0.5MM]  8.75,28.05 270 bottom
U22  TS4231  [WLCSP3X3]  23.5,16.35 0 top
U23  TS4231  [WLCSP3X3]  3.12,36.51 315 top
U24  LT3463  [DFN103X3]  15,34.2 90 top
U25  TS4231  [WLCSP3X3]  11.83,18.01 180 top
U26  TLV70733  [X2SON]  22.88,28.1 0 bottom
U27  TS4231  [WLCSP3X3]  4.64,11.87 45 top
U28  RHD2064_BGA  [BGA104_0.5MM]  12.95,17.75 180 bottom
U29  RHD2064_BGA  [BGA104_0.5MM]  23.25,21.95 90 bottom
U30  MIC23150  [TDFN_2X2MM]  27.3,27.12 180 top
U31  TS4231  [WLCSP3X3]  15.37,39.84 0 top
U32  TS4231  [WLCSP3X3]  17.83,11.36 180 top
U33  TPS8268180  [MICROSIP9-3X2.3]  29.2,22.9 180 top
VCOAX  [TP10R]  21.61,29.62 0 top
Y1  FW1600008  [FW2X1.6MM]  8.47,16.2 0 top
Y2  ECS-.327-12.5-1210-TR  [ECX-1210]  5.45,24.65 180 top

## Tracks (layer width: path | path; a pad name or v marks a point on that pad's centre or on a via)
!IMU_BL
  Top 0.1: 6.71,28.5 | 6.71,28.5 7.62,28.5 U17.4 | 5.82,28.5 6.71,28.5 | 5.82,28.5 5.82,28.09 R55.2 | 5.82,28.5 5.15,28.5 4.93,28.72 4.93,29.2 TP11.TP
!IMU_RESET  (via drill 0.1 layers 1-6)
  Top 0.076: v7.05,25.6 U17.11
  Top 0.1: 6.57,25.6 U17.11 6.22,25.6 R57.1 | 7.1,25.6 v7.05,25.6
  Signal 0.076: v7.05,25.6 11.4,25.6 12.4,26.6 U14.P4
  other vias: 13,26.6
  pour Top (no thermals): 6.97,25.6 arc180 7.13,25.6 arc180
  pour Signal (no thermals): 6.97,25.6 arc180 7.13,25.6 arc180
  pour Top (no thermals): 6.97,25.6 arc180 7.13,25.6 arc180
  pour Signal (no thermals): 12.92,26.6 arc180 13.08,26.6 arc180
!LIPO_ALRT  (via drill 0.1 layers 1-6)
  Top 0.076: U16.B4 24.6,34.6 R50.1
  Signal 0.076: U16.B4 24.7,34.1 24.7,32.39 20.19,27.88 18.93,27.88 18.26,27.21 18.26,25.99 18.1,25.82 17.88,25.82 17.77,25.73 17.77,25.38 U14.E7
  other vias: 24.6,34.2 17.5,25.1
  pour Top (no thermals): 24.52,34.2 arc180 24.68,34.2 arc180
  pour Signal (no thermals): 24.52,34.2 arc180 24.68,34.2 arc180
  pour Signal (no thermals): 17.42,25.1 arc180 17.58,25.1 arc180
+1V8  (via drill 0.2 layers 1-6, 0.3 layers 1-6)
  Top 0.1: U7.11 28.35,18.3 28.51,18.14 29.53,18.14 29.7,18.32 R38.1
  Top 0.2: C12.1 27.35,12.97 C13.1 27.35,13.2 U7.28 27.35,14.1 27.6,14.35 v27.85,14.35 | U7.11 28.35,18.9 28.73,19.27 C14.1
  Top 0.3: C14.1 C15.1 28.73,20.29 C16.1 | L2.1 24.5,19.5 v24.65,19.5
  Signal 0.3: U7.11 28.11,18.36 28.11,14.96 27.85,14.7 v27.85,14.35
  Supply 0.3: v24.65,19.5 25.5,19.5 25.95,19.05 26.55,19.05 27,18.6 U7.11
  other vias: 28.35,18.6
  pour Top (isolate 0.05, rank 2, no thermals): 29,22.5 29,20.98 28.25,20.98 28.25,20.25 28.27,20.23 29.25,20.23 29.25,21.55 30.25,21.57 30.25,20.95 30.82,20.95 30.82,22.5
  pour Top (no thermals): 28.22,18.6 arc180 28.48,18.6 arc180
  pour Top (no thermals): 28.22,18.6 arc180 28.48,18.6 arc180
  pour Signal (no thermals): 28.22,18.6 arc180 28.48,18.6 arc180
  pour Supply (no thermals): 28.22,18.6 arc180 28.48,18.6 arc180
  pour Signal (no thermals): 27.72,14.35 arc180 27.98,14.35 arc180
  pour Top (no thermals): 27.72,14.35 arc180 27.98,14.35 arc180
  pour Supply (no thermals): 24.45,19.5 arc180 24.85,19.5 arc180
  pour Top (no thermals): 24.45,19.5 arc180 24.85,19.5 arc180
+3V3  (via drill 0.1, 0.1 layers 1-6, 0.2, 0.2 layers 1-6)
  Top 0.051: 3V1.TP v20.35,29.6
  Top 0.076: v19.2,15.88 19.36,15.88 J11.18 | v25.85,13.82 U7.25 | 30.49,19.65 R42.1 30.16,19.9 v30.16,20.13 | 5.85,12.37 C75.1 v5.87,12.37
  Top 0.1: v4.93,28.07 R55.1 | v11.1,19.12 R76.2 | R83.1 | R84.1 | v24.85,35.7 R50.2 | R53.1 13.53,30.02 v13.65,30.15 | v14.4,39.33 R45.2 | R54.1 v25.8,29.7 | R77.2 11.85,19.32 v11.6,19.07 | U18.4 U18.1 | v4.88,26.07 R57.2 | v8.3,10.04 R37.1 | R36.1 v27.3,34.9
  Top 0.2: U31.C3 15.96,39.26 C79.1 | C79.1 | C47.1 v6.32,28.9 C46.1 | U17.28 9.65,27.6 9.35,27.9 9.35,28.35 9.03,28.68 8.38,28.68 C45.1 v8.11,29.21 | U32.C3 16.64,11.86 C98.1 v16.2,11.9 | 7.28,35.17 U13.VDD | C43.1 v5.68,34.62 | v10.55,18.93 C71.1 11.27,18.57 U25.C3 | U12.7 C42.1 17.02,14.5 v17.02,14.64 | v7.62,19.88 7.62,19.27 | 7.62,19.27 J12.8 | 7.62,19.27 J12.7 | v16.57,38.95 C79.1 | U11.7 14.72,38.5 v14.45,38.23 14.18,38.23 C41.1 | v1.8,35.45 2.29,35.45 C66.1 2.85,35.53 U23.C3 | C51.1 12.75,20.05 U18.4 v13.45,20 | J11.18 J11.17 | U22.C3 24.06,15.81 C60.1 24.22,15.31 v24.22,15.38 | 25.85,13.22 C17.1 | 25.85,13.22 C18.1 25.8,13.25 | U7.25 25.85,13.22 | U3.2 v17.86,37.4 C7.1 | v15.52,12.25 C9.1 15.52,12.72 15.42,12.82 U4.2 | 5.85,12.37 U27.C3
  Top 0.3: U30.4 29.05,27.88 C77.1 | L7.2 0.78,19.5 v0.97,19.7 0.97,19.35 v0.95,19.32 | U13.VDD 6.7,35.3 6.3,34.9 6.3,34.6 6.03,34.33 C43.1
  Signal 0.2: U17.3 7.98,28.65 6.57,28.65 v6.32,28.9
  Bottom 0.051: L17.1 13.58,25.28 v13.6,25.3 | L19.1 12.48,23.58 v12.5,23.6
  Bottom 0.076: L18.1 16.56,27.98 | R87.1 v17,23.55 | R88.1 18.6,25.35 v18.5,25.25
  Bottom 0.2: C102.1 U14.J8 | C99.1 15.9,25.1 R52.1 16.85,25.7 R89.1 | 16.45,27.95 L18.1 16.53,28.58 v16.88,28.93
  Bottom 0.3: v25.48,30.1 25.45,30.07 R72.2
  other vias: 15.5,24.6 16,24.1 16.5,24.6 16,25.1 13.75,16.65 14.5,16.65 29.48,28.05 29.55,27.5 28.88,28 28.98,27.5 29.23,27.8 29.8,27.15 30,26.7 29.35,27.05 8.47,28.15
  pour Supply (isolate 0.1, rank 2, no thermals): 0,41 0,9 32,9 32,41
  pour Bottom (no thermals): 15.2,24.6 16,25.4 16.8,24.6 16,23.8
  pour Top (isolate 0.05, rank 2, no thermals): 28.45,27.7 28.75,27.4 28.75,26.3 29.05,26 30.5,26 30.5,27.05 30.15,27.05 29.75,27.45 29.75,28.3 28.75,28.3 28.45,28
  pour Bottom (no thermals): 15.42,24.6 arc180 15.58,24.6 arc180
  pour Bottom (no thermals): 16.92,23.55 arc180 17.08,23.55 arc180
  pour Bottom (no thermals): 18.42,25.25 arc180 18.58,25.25 arc180
  pour Bottom (no thermals): 16.75,28.93 arc180 17,28.93 arc180
  pour Top (no thermals): 20.27,29.6 arc180 20.43,29.6 arc180
  pour Bottom (no thermals): 13.52,25.3 arc180 13.68,25.3 arc180
  pour Bottom (no thermals): 12.42,23.6 arc180 12.58,23.6 arc180
  pour Top (no thermals): 14.32,38.23 arc180 14.58,38.23 arc180
  pour Top (no thermals): 14.32,38.23 arc180 14.58,38.23 arc180
  pour Top (no thermals): 14.32,39.33 arc180 14.48,39.33 arc180
  pour Top (no thermals): 16.45,38.95 arc180 16.7,38.95 arc180
  pour Top (no thermals): 5.55,34.62 arc180 5.8,34.62 arc180
  pour Top (no thermals): 24.09,15.38 arc180 24.34,15.38 arc180
  pour Top (no thermals): 0.82,19.32 arc180 1.08,19.32 arc180
  pour Top (no thermals): 0.85,19.7 arc180 1.1,19.7 arc180
  pour Top (no thermals): 0.85,19.7 arc180 1.1,19.7 arc180
  pour Top (no thermals): 16.07,11.9 arc180 16.33,11.9 arc180
  pour Top (no thermals): 10.42,18.93 arc180 10.68,18.93 arc180
  pour Top (no thermals): 4.85,28.07 arc180 5,28.07 arc180
  pour Top (no thermals): 1.67,35.45 arc180 1.93,35.45 arc180
  pour Top (no thermals): 11.02,19.12 arc180 11.18,19.12 arc180
  pour Top (no thermals): 11.52,19.07 arc180 11.68,19.07 arc180
  pour Top (no thermals): 13.68,16.65 arc180 13.83,16.65 arc180
  pour Top (no thermals): 14.42,16.65 arc180 14.57,16.65 arc180
  pour Top (no thermals): 5.74,12.37 arc180 6,12.37 arc180
  pour Top (no thermals): 16.95,14.64 arc180 17.1,14.64 arc180
  pour Bottom (no thermals): 25.35,30.1 arc180 25.6,30.1 arc180
  pour Top (no thermals): 24.77,35.7 arc180 24.93,35.7 arc180
  pour Top (no thermals): 13.57,30.15 arc180 13.73,30.15 arc180
  pour Top (no thermals): 7.5,19.88 arc180 7.75,19.88 arc180
  pour Top (no thermals): 25.72,13.82 arc180 25.98,13.82 arc180
  pour Top (no thermals): 19.07,15.88 arc180 19.33,15.88 arc180
  pour Top (no thermals): 25.72,29.7 arc180 25.88,29.7 arc180
  pour Top (no thermals): 6.19,28.9 arc180 6.45,28.9 arc180
  pour Top (no thermals): 6.19,28.9 arc180 6.45,28.9 arc180
  pour Signal (no thermals): 6.19,28.9 arc180 6.45,28.9 arc180
  pour Top (no thermals): 7.98,29.21 arc180 8.24,29.21 arc180
  pour Top (no thermals): 13.32,20 arc180 13.58,20 arc180
  pour Top (no thermals): 4.8,26.07 arc180 4.95,26.07 arc180
  pour Top (no thermals): 8.22,10.04 arc180 8.38,10.04 arc180
  pour Top (no thermals): 27.22,34.9 arc180 27.38,34.9 arc180
  pour Top (no thermals): 30.08,20.13 arc180 30.24,20.13 arc180
  pour Top (no thermals): 17.73,37.4 arc180 17.98,37.4 arc180
  pour Top (no thermals): 17.73,37.4 arc180 17.98,37.4 arc180
  pour Top (no thermals): 15.39,12.25 arc180 15.65,12.25 arc180
  pour Signal (no thermals): 8.35,28.15 arc180 8.6,28.15 arc180
+3V3_AN
  Bottom 0.3: C74.1 25.45,28.52 R75.1
  Bottom 0.4: L15.1 C74.1
+15V0  (via drill 0.2 layers 1-6, 0.3 layers 1-6)
  Top 0.2: v7.7,12.23 7.7,12.13 7.45,11.88 U6.12 6.71,11.88 C23.1 | C22.1 25.68,37.1 U5.12 26,37.1 26.55,37.65 v26.55,38.1 | U1.3 20.97,38.77 20.28,38.77 C1.1 | C2.1 10.71,12.01 v10.54,11.96 v10.54,11.97 U2.3
  Top 0.3: C65.1 13.3,31.88 13.3,32.85 | R74.2 13.3,36.2 | 13.3,32.85 13.3,36.2 | U24.1 13.35,32.8 13.3,32.85 | 13.3,36.2 12.97,36.53 12.97,37.57 13.01,37.61 v13.92,37.61 | v21.03,38.78 20.27,38.77 20.28,38.77
  Signal 0.2: 31.2,25.05 31.2,24.5 31.2,22.05
  Signal 0.3: v21.03,38.78 23.76,38.78 24.37,39.4 25.25,39.4 v26.55,38.1 26.59,38.06 27.09,38.06 28.4,36.75 28.4,36.5
  Signal 0.4: 31.2,25.05 31.2,33.7 28.4,36.5 | v28.82,12.38 25.9,9.45 v20.15,9.45 | v31.6,21.45 31.2,21.85 31.2,22.05
  Supply 0.2: v31.6,21.45 31.6,20.81 31.12,20.33 31.12,19.93 | v10.54,11.96 v10.53,11.96 10.53,12.23
  Supply 0.3: v20.15,9.45 19.75,9.85 16.45,9.85 16.15,9.55 13.61,9.55 10.93,12.23 10.53,12.23 v7.7,12.23 | v21.03,38.78 20.81,38.78 20.03,38.01 19.15,38.01 19.04,38.12 16.34,38.12 15.88,38.58 14.3,38.58 13.92,38.19 v13.92,37.61
  Supply 0.4: v28.82,12.38 31.15,14.7 31.12,14.7 31.12,19.93
  pour Supply (no thermals): 31.4,21.45 arc180 31.8,21.45 arc180
  pour Signal (no thermals): 31.4,21.45 arc180 31.8,21.45 arc180
  pour Supply (no thermals): 28.62,12.38 arc180 29.02,12.38 arc180
  pour Signal (no thermals): 28.62,12.38 arc180 29.02,12.38 arc180
  pour Signal (no thermals): 19.95,9.45 arc180 20.35,9.45 arc180
  pour Supply (no thermals): 19.95,9.45 arc180 20.35,9.45 arc180
  pour Top (no thermals): 7.57,12.23 arc180 7.83,12.23 arc180
  pour Supply (no thermals): 7.57,12.23 arc180 7.83,12.23 arc180
  pour Top (no thermals): 26.42,38.1 arc180 26.68,38.1 arc180
  pour Signal (no thermals): 26.42,38.1 arc180 26.68,38.1 arc180
  pour Signal (no thermals): 26.42,38.1 arc180 26.68,38.1 arc180
  pour Top (no thermals): 13.72,37.61 arc180 14.12,37.61 arc180
  pour Supply (no thermals): 13.72,37.61 arc180 14.12,37.61 arc180
  pour Top (no thermals): 20.91,38.78 arc180 21.16,38.78 arc180
  pour Supply (no thermals): 20.91,38.78 arc180 21.16,38.78 arc180
  pour Signal (no thermals): 20.91,38.78 arc180 21.16,38.78 arc180
  pour Top (no thermals): 10.42,11.96 arc180 10.67,11.96 arc180
  pour Supply (no thermals): 10.42,11.96 arc180 10.67,11.96 arc180
  pour Top (no thermals): 10.42,11.96 arc180 10.67,11.96 arc180
-15V0  (via drill 0.2 layers 1-6, 0.3 layers 1-6)
  Top 0.2: C27.1 8.9,10.68 v8.9,11.88 U6.1 8.4,11.88 8.3,11.98 8.3,12.63 8.3,12.64 v8.3,12.78 | U5.1 27.6,37.1 | 27.6,37.1 v27.6,36.8 | 27.6,37.1 27.7,37.1 27.85,37.25 C26.1 | U1.PAD 22.63,38.78 U1.10 24.14,38.78 C10.1 | v13.81,11.98 12.15,11.97 v11.93,12.36 | C11.1 v13.81,11.98 | U2.10 v13.81,11.98
  Top 0.3: D8.A 18.13,34.71 C70.1 17.6,35.63 R85.1 C68.2 17.8,36.6 v19.57,36.59 | U2.PAD 12.07,12.22 v11.93,12.36
  Signal 0.2: v31.21,20.96 30.8,21.37 30.8,24.45 | v27.6,36.8 27.38,36.67
  Signal 0.3: 23.97,36.67 23.97,38.11 C10.1 | 12.01,12.36 v11.93,12.36 9.38,12.36 v8.9,11.88
  Signal 0.4: 30.8,24.45 30.6,24.65 30.6,33.45 27.38,36.67 23.97,36.67 19.66,36.67 v19.57,36.59 | v20.5,10.1 25.68,10.1 v28.4,12.82
  Supply 0.3: v20.5,10.1 20.31,10.3 15.5,10.3 13.83,11.97 v13.81,11.98
  Supply 0.4: v28.4,12.82 30.55,14.97 30.55,20.3 v31.21,20.96
  other vias: 24.39,38.53
  pour Top (no thermals): 27.47,36.8 arc180 27.73,36.8 arc180
  pour Signal (no thermals): 27.47,36.8 arc180 27.73,36.8 arc180
  pour Signal (no thermals): 31.01,20.96 arc180 31.41,20.96 arc180
  pour Supply (no thermals): 31.01,20.96 arc180 31.41,20.96 arc180
  pour Supply (no thermals): 28.2,12.82 arc180 28.6,12.82 arc180
  pour Signal (no thermals): 28.2,12.82 arc180 28.6,12.82 arc180
  pour Signal (no thermals): 20.3,10.1 arc180 20.7,10.1 arc180
  pour Supply (no thermals): 20.3,10.1 arc180 20.7,10.1 arc180
  pour Top (no thermals): 8.17,12.78 arc180 8.43,12.78 arc180
  pour Top (no thermals): 19.37,36.59 arc180 19.77,36.59 arc180
  pour Signal (no thermals): 19.37,36.59 arc180 19.77,36.59 arc180
  pour Top (no thermals): 24.26,38.53 arc180 24.52,38.53 arc180
  pour Signal (no thermals): 24.26,38.53 arc180 24.52,38.53 arc180
  pour Supply (no thermals): 13.68,11.98 arc180 13.93,11.98 arc180
  pour Top (no thermals): 13.68,11.98 arc180 13.93,11.98 arc180
  pour Top (no thermals): 13.68,11.98 arc180 13.93,11.98 arc180
  pour Top (no thermals): 13.68,11.98 arc180 13.93,11.98 arc180
  pour Top (no thermals): 11.73,12.36 arc180 12.13,12.36 arc180
  pour Signal (no thermals): 11.73,12.36 arc180 12.13,12.36 arc180
  pour Signal (no thermals): 11.73,12.36 arc180 12.13,12.36 arc180
  pour Top (no thermals): 11.73,12.36 arc180 12.13,12.36 arc180
  pour Top (no thermals): 8.77,11.88 arc180 9.03,11.88 arc180
  pour Top (no thermals): 8.77,11.88 arc180 9.03,11.88 arc180
  pour Signal (no thermals): 8.77,11.88 arc180 9.03,11.88 arc180
A/D_IN1
  Top 0.051: U14.D4 18.7,25.9 18.7,22.93 18.7,22.92 18.7,22.78 18.7,22.77 18.7,21.02 18.7,20 18.7,19.7 18.6,19.6 J11.5
A/D_VREF
  Top 0.051: U14.F4 17.25,26.35 17.25,24 17.4,23.85 17.6,23.85 17.75,23.7 17.75,20.8 18.2,20.35 J11.6
ADAPT_SIG  (3 unrouted)
  Top 0.2: D1.C 21.2,4.1 21.1,4 | D2.C 12.28,46.17 12.1,46
  Top 0.7: J5.SIG 12.1,46 J6.SIG
  Top 1.1: J4.SIG 21.1,4 J3.SIG
AGND  (via drill 0.1 layers 7-16, 0.2 layers 7-16)
  Bottom 0.051: U29.M17 v21,25.7
  Bottom 0.1: U29.N6 v20,20.45 | v21,18.2 U29.M2 | v9.2,20 U28.M2 | U28.N1 v9.2,20.5 | U29.N1 v20.55,18.2 | v11,31.8 U21.M2 | v11.5,31.8 U21.N1 | v22.8,30 U20.M2 | v22.8,29.5 U20.N1
  Bottom 0.2: v27.9,14.8 27.9,15.13 JD.70 | v22.2,14.9 22,15.1 R94.1 | JA.70 25.91,36.95 v26.25,36.95 | JC.70 4.05,34.91 v4.05,35.25 | JB.70 6.13,13.1 v5.75,13.1 | v21.25,27.75 C81.2 | v21.9,27.75 C93.1 | v18.75,19.1 C92.1 | v18.75,19.8 C80.2 | C63.1 v10.09,22.25 v10.1,22.25 | C59.2 v10.79,22.25 v10.8,22.25 | v13.25,30.15 C58.2 | v13.25,30.9 C62.1
  other vias: 0.6,34.65 11.45,21.05 0.68,33.67 0.62,32.3 0.9,30.38 0.6,29 0.53,27.25 0.57,25.12 0.57,23.75 0.6,22.38 0.57,20.82 2.6,20.38 3.43,20.52 3.07,19.5 1.35,18.62 0.6,18.4 2.1,16.43 1.43,17.23 0.8,16.23 2.5,15.55 1.95,13.62 3.6,13.05 4.6,14.2 3.43,15.62 4.95,17.48 6,18.7 3.88,19.8 7.15,20.7 8.43,20.45 8.9,21.95 4.28,11.85 5.32,10.5 6.43,9.57 8.1,9.53 9.68,9.57 11.25,9.5 13,9.53 14.78,9.57 16.6,9.75 18.43,9.78 19.77,9.8 21.85,9.7 24.15,9.68 25.43,9.85 27.32,11 25.15,11.2 24.27,11.65 23.07,12.7 21.73,13.97 19.45,14.47 21.75,15.43 23.48,14.05 24.17,14.85 28.8,12.53 29.68,14.15 31.07,14.78 31.1,16.27 31.18,17.48 31.15,18.5 31.15,20.85 31.18,21.85 31.18,23.6 31.18,22.52 31.1,25.05 31.15,26.23 31.12,27.6 31.5,28.43 30.2,29 28.57,29.27 28.5,30.73 30.3,30.77 31.27,30.9 31.3,32.02 26.55,29.45 25.95,28.52 26.98,30.85 26.52,32.3 27.98,33.12 29.23,34.02 30.98,34.5 30.35,35.6 27.93,35.42 26.23,34.98 25.88,36 28,38.25 29.32,36.9 29.25,35.08 26.98,38.17 26.98,39 25.6,40.48 23.7,40.4 21.68,40.42 20.35,40.35 19.32,40.1 17.18,40.12 15.5,40.25 14.05,40.35 12.2,40.23 11.4,38.08 10.97,40.17 9.6,40.27 10.72,38.05 6.6,40.08 9.5,36.95 11.3,35.9 12.57,35.62 9.18,34.73 8.68,35.95 6.9,36.73 5.28,39.23 5.47,36.27 4.3,37.6 2.82,36.9 1.5,35.85 20.85,11.3 20.73,12.53 27.57,12.7 6.65,38.35 5.68,38.2 7.97,39.38 0.93,14.93 10,19 10,18 10,17 10,16 11,16 11,17 11,18 11,19 12,19 12,18 12,17 12,16 13,16 13,17 13,18 13,19 14,19 14,18 14,17 14,16 15,16 15,17 15,18 15,19 16,19 16,18 16,17 16,16 22,19 23,19 24,19 25,19 25,20 24,20 23,20 22,20 22,21 23,21 24,21 25,21 22,25 23,25 24,25 25,25 22,24 23,24 24,24 25,24 22,23 23,23 24,23 25,23 22,22 23,22 24,22 25,22 17,31 17,32 17,33 17,34 18,31 18,32 18,33 18,34 19,31 19,32 19,33 19,34 20,31 20,32 20,33 20,34 21,31 21,32 21,33 21,34 22,31 22,32 22,33 22,34 16,31 16,32 16,33 16,34 7,31 8,31 9,31 10,31 7,30 8,30 9,30 10,30 7,29 8,29 9,29 10,29 7,28 8,28 9,28 10,28 7,27 8,27 9,27 10,27 7,26 8,26 9,26 10,26 7,25 8,25 9,25 10,25 11.25,24.05 16.95,20.25 14.1,29.25 12.45,29.85 13.3,32.05 11.4,32.55 18.95,17.8 20.65,29.1 21.3,28.55 20.8,27.5 12.4,33.7 12.6,34.4 15.05,29.75 6.3,21.65 5,21.3 19.5,15.72 20.65,13.82 3.95,16.62 27.57,32.1
  pour Bottom (isolate 0.1, rank 3, no thermals): 0,41 0,9 32,9 32,41
  pour AGND (isolate 0.05, rank 3, no thermals): 0,41 32,41 32,9 0,9
  pour Bottom (no thermals): 19.92,20.45 arc180 20.08,20.45 arc180
  pour Bottom (no thermals): 20.92,18.2 arc180 21.08,18.2 arc180
  pour Bottom (no thermals): 20.47,18.2 arc180 20.63,18.2 arc180
  pour Bottom (no thermals): 22.07,14.9 arc180 22.33,14.9 arc180
  pour Bottom (no thermals): 27.77,14.8 arc180 28.03,14.8 arc180
  pour Bottom (no thermals): 9.12,20.5 arc180 9.28,20.5 arc180
  pour Bottom (no thermals): 9.12,20 arc180 9.28,20 arc180
  pour Bottom (no thermals): 5.62,13.1 arc180 5.88,13.1 arc180
  pour Bottom (no thermals): 3.92,35.25 arc180 4.18,35.25 arc180
  pour Bottom (no thermals): 26.12,36.95 arc180 26.38,36.95 arc180
  pour Bottom (no thermals): 21.12,27.75 arc180 21.38,27.75 arc180
  pour Bottom (no thermals): 21.77,27.75 arc180 22.03,27.75 arc180
  pour Bottom (no thermals): 18.62,19.8 arc180 18.88,19.8 arc180
  pour Bottom (no thermals): 18.62,19.1 arc180 18.88,19.1 arc180
  pour Bottom (no thermals): 9.97,22.25 arc180 10.23,22.25 arc180
  pour Bottom (no thermals): 10.67,22.25 arc180 10.93,22.25 arc180
  pour Bottom (no thermals): 13.12,30.15 arc180 13.38,30.15 arc180
  pour Bottom (no thermals): 11.42,31.8 arc180 11.58,31.8 arc180
  pour Bottom (no thermals): 10.92,31.8 arc180 11.08,31.8 arc180
  pour Bottom (no thermals): 20.92,25.7 arc180 21.08,25.7 arc180
  pour Bottom (no thermals): 22.72,29.5 arc180 22.88,29.5 arc180
  pour Bottom (no thermals): 22.72,30 arc180 22.88,30 arc180
  pour Bottom (no thermals): 13.12,30.9 arc180 13.38,30.9 arc180
ANT
  Top 0.4: C30.2 2.54,23.64 C31.2 2.72,24.98 J10.P$1
AUXIN1_A
  Bottom 0.051: U20.N3 22.3,29 23.2,29 23.4,29.2 23.4,29.75 24.1,30.45 24.85,30.45 25,30.6 25,31.75 27,33.75 TP16.TP 28.55,34 29.85,32.7 29.85,29.65 29.25,29.05 29.25,28.6 29.5,28.35 JD.34
AUXIN1_B
  Bottom 0.051: U28.N3 9.64,21.05 8.55,21.05 7,19.5 7,18.2 5,16.2 TP28.TP 3.5,16 1.78,17.73 1.78,20.02 2.5,20.75 2.65,20.9 2.65,21.5 2.5,21.65 JC.34
AUXIN1_C  (via drill 0.1 layers 7-16)
  AGND 0.051: v5.4,34.65 v5.85,35.1
  Bottom 0.051: U21.N3 12.1,31.41 12.1,32.3 10.4,34 9.15,34 7.65,35.5 TP18.TP 6.25,35.5 v5.85,35.1 | JC.69 5.2,34.45 v5.4,34.65
  pour Bottom (no thermals): 5.32,34.65 arc180 5.48,34.65 arc180
  pour AGND (no thermals): 5.32,34.65 arc180 5.48,34.65 arc180
  pour AGND (no thermals): 5.77,35.1 arc180 5.93,35.1 arc180
  pour Bottom (no thermals): 5.77,35.1 arc180 5.93,35.1 arc180
AUXIN1_D  (via drill 0.1 layers 7-16)
  AGND 0.051: v26.85,15.25 v26.4,14.8
  Bottom 0.051: U29.N3 20,18.7 20,17.7 21.7,16 22.55,16 24.05,14.5 TP30.TP | TP30.TP 25.65,14.6 | JD.69 27.15,15.55 v26.85,15.25 | v26.4,14.8 26.1,14.5 TP30.TP
  pour Bottom (no thermals): 26.77,15.25 arc180 26.93,15.25 arc180
  pour AGND (no thermals): 26.77,15.25 arc180 26.93,15.25 arc180
  pour AGND (no thermals): 26.32,14.8 arc180 26.47,14.8 arc180
  pour Bottom (no thermals): 26.32,14.8 arc180 26.47,14.8 arc180
AUXIN2_A
  Bottom 0.051: U20.N4 21.95,28.85 23.35,28.85 23.7,29.2 23.7,29.85 24.2,30.35 24.89,30.35 27.15,30.35 | TP17.TP 27.15,30.35 | 27.15,30.35 27.88,29.62 JD.36
AUXIN2_B
  Bottom 0.051: U28.N4 9.95,21.25 8.3,21.25 6.75,19.7 4.9,19.7 | 4.9,19.7 TP29.TP | JC.36 4.12,20.48 4.9,19.7
AUXIN2_C
  Bottom 0.051: TP19.TP 8.6,36.9 10.6,34.9 10.6,34.15 12.35,32.4 12.35,31.16 U21.N4
AUXIN2_D
  Bottom 0.051: TP31.TP 23.3,13.1 21.4,15 21.4,15.85 19.8,17.45 19.8,18.2 | 19.8,19 19.83,19.02 | 19.83,19.02 U29.N4 | 19.8,18.2 19.8,18.25 | 19.83,19.02 19.8,19 | 19.8,19 19.8,18.2
AUXIN3_C
  Bottom 0.051: TP20.TP 10.85,36.75 10.85,34.25 12.6,32.5 12.6,30.91 U21.N5
AUXIN3_D
  Bottom 0.051: U29.N5 19.6,19.3 19.6,17.2 21.2,15.6 21.2,13.2 TP32.TP
CONF_DONE  (via drill 0.1)
  Bottom 0.076: R89.2 U14.E6
  other vias: 17.5,25.6
  pour Bottom (no thermals): 17.42,25.6 arc180 17.58,25.6 arc180
CONFIG_SEL  (via drill 0.1)
  other vias: 18,24.6
DAC_A_CS  (via drill 0.1 layers 1-6)
  Signal 0.076: U14.G2 16.5,28.45 16.35,28.6 16.35,29.2 16.5,29.35 16.5,37.5 17.86,38.86 17.86,39.52 18.11,39.77 18.66,39.77 U3.5
  other vias: 16.5,27.6 18.85,39.58
  pour Signal (no thermals): 16.42,27.6 arc180 16.58,27.6 arc180
  pour Signal (no thermals): 18.77,39.58 arc180 18.93,39.58 arc180
DAC_B_CS  (via drill 0.1 layers 1-6)
  Top 0.076: U4.5 16.48,15 v16.6,15
  Signal 0.076: U14.J11 16,23.1 16.6,22.5 v16.6,15
  other vias: 15.5,23.1
  pour Signal (no thermals): 15.42,23.1 arc180 15.58,23.1 arc180
  pour Signal (no thermals): 16.52,15 arc180 16.68,15 arc180
  pour Top (no thermals): 16.52,15 arc180 16.68,15 arc180
DIN0  (via drill 0.1 layers 1-6)
  Signal 0.076: U7.19 24.5,17.65 23.02,17.65 20.75,19.93 20.75,22.25 20.2,22.8 19.3,22.8 U14.B11
  other vias: 25.2,16.95 19,23.1
  pour Signal (no thermals): 25.12,16.95 arc180 25.28,16.95 arc180
  pour Signal (no thermals): 18.92,23.1 arc180 19.08,23.1 arc180
DIN1  (via drill 0.1 layers 1-6)
  Signal 0.076: U7.20 24.35,17.3 22.93,17.3 20.55,19.68 20.55,22.1 20.05,22.6 U14.B12
  other vias: 25.2,16.45 19,22.6
  pour Signal (no thermals): 25.12,16.45 arc180 25.28,16.45 arc180
  pour Signal (no thermals): 18.92,22.6 arc180 19.08,22.6 arc180
DIN2  (via drill 0.1 layers 1-6)
  Signal 0.076: U7.21 24.2,16.95 22.85,16.95 20.35,19.45 20.35,21.9 19.9,22.35 18.8,22.35 18.05,23.1 U14.D11
  other vias: 25.2,15.95 18,23.1
  pour Signal (no thermals): 25.12,15.95 arc180 25.28,15.95 arc180
  pour Signal (no thermals): 17.92,23.1 arc180 18.08,23.1 arc180
DIN3  (via drill 0.1 layers 1-6)
  Signal 0.076: U7.22 24.05,16.6 23.95,16.6 22.77,16.6 20.15,19.23 20.15,21.7 19.75,22.1 U14.A13
  other vias: 25.2,15.45 19.5,22.1
  pour Signal (no thermals): 25.12,15.45 arc180 25.28,15.45 arc180
  pour Signal (no thermals): 19.42,22.1 arc180 19.58,22.1 arc180
DIN4  (via drill 0.1 layers 1-6)
  Signal 0.076: U14.B13 19.25,21.85 19.6,21.85 19.95,21.5 19.95,18.98 23.98,14.95 U7.23
  other vias: 25.2,14.95 19,22.1
  pour Signal (no thermals): 25.12,14.95 arc180 25.28,14.95 arc180
  pour Signal (no thermals): 18.92,22.1 arc180 19.08,22.1 arc180
DIN5  (via drill 0.1 layers 1-6)
  Signal 0.076: U7.24 24,14.45 19.75,18.7 19.75,21.35 U14.A14
  other vias: 25.2,14.45 19.5,21.6
  pour Signal (no thermals): 25.12,14.45 arc180 25.28,14.45 arc180
  pour Signal (no thermals): 19.42,21.6 arc180 19.58,21.6 arc180
DIN6  (via drill 0.1 layers 1-6)
  Signal 0.076: U7.26 26.05,14.1 23.9,14.1 19.52,18.48 19.52,20.68 19.26,20.95 19.26,21.34 U14.B14
  other vias: 26.35,13.8 19,21.6
  pour Signal (no thermals): 26.27,13.8 arc180 26.43,13.8 arc180
  pour Signal (no thermals): 18.92,21.6 arc180 19.08,21.6 arc180
DIN7  (via drill 0.1 layers 1-6)
  Signal 0.076: U7.27 26.59,13.54 24.01,13.54 19.3,18.25 19.3,20.55 19,20.85 U14.B15
  other vias: 26.85,13.8 19,21.1
  pour Signal (no thermals): 26.77,13.8 arc180 26.93,13.8 arc180
  pour Signal (no thermals): 18.92,21.1 arc180 19.08,21.1 arc180
DIN8  (via drill 0.1 layers 1-6)
  Top 0.076: U7.29 v27.85,13.9
  Signal 0.076: U14.A9 19.5,24.6 20.1,25.2 21.5,25.2 22.4,26.1 26.4,26.1 26.64,25.86 26.64,21.8 28.59,19.86 28.59,14.64 v27.85,13.9
  other vias: 19.5,24.1
  pour Top (no thermals): 27.77,13.9 arc180 27.93,13.9 arc180
  pour Signal (no thermals): 27.77,13.9 arc180 27.93,13.9 arc180
  pour Signal (no thermals): 19.42,24.1 arc180 19.58,24.1 arc180
DIN9  (via drill 0.1 layers 1-6)
  Top 0.076: U7.30 v28.35,13.9
  Signal 0.076: U14.A7 19.82,25.43 21.35,25.43 22.23,26.3 26.55,26.3 26.9,25.95 26.9,21.95 28.88,19.98 28.88,14.43 v28.35,13.9
  other vias: 19.5,25.1
  pour Top (no thermals): 28.27,13.9 arc180 28.43,13.9 arc180
  pour Signal (no thermals): 28.27,13.9 arc180 28.43,13.9 arc180
  pour Signal (no thermals): 19.42,25.1 arc180 19.58,25.1 arc180
DIN10  (via drill 0.1 layers 1-6)
  Top 0.076: U7.31 v28.85,13.9
  Signal 0.076: v28.85,13.9 29.15,14.2 29.15,20.1 27.15,22.1 27.15,26.05 26.7,26.5 22.1,26.5 21.25,25.65 19.7,25.65 19.25,25.2 19.25,24.85 U14.B8
  other vias: 19,24.6
  pour Signal (no thermals): 28.77,13.9 arc180 28.93,13.9 arc180
  pour Top (no thermals): 28.77,13.9 arc180 28.93,13.9 arc180